# EAGLE design BIRDS_X_APRS_v1.4 (EAGLE 9.6.2)

## Sheet 1 of 3: MULTI-SPEC CAMERA MISSION
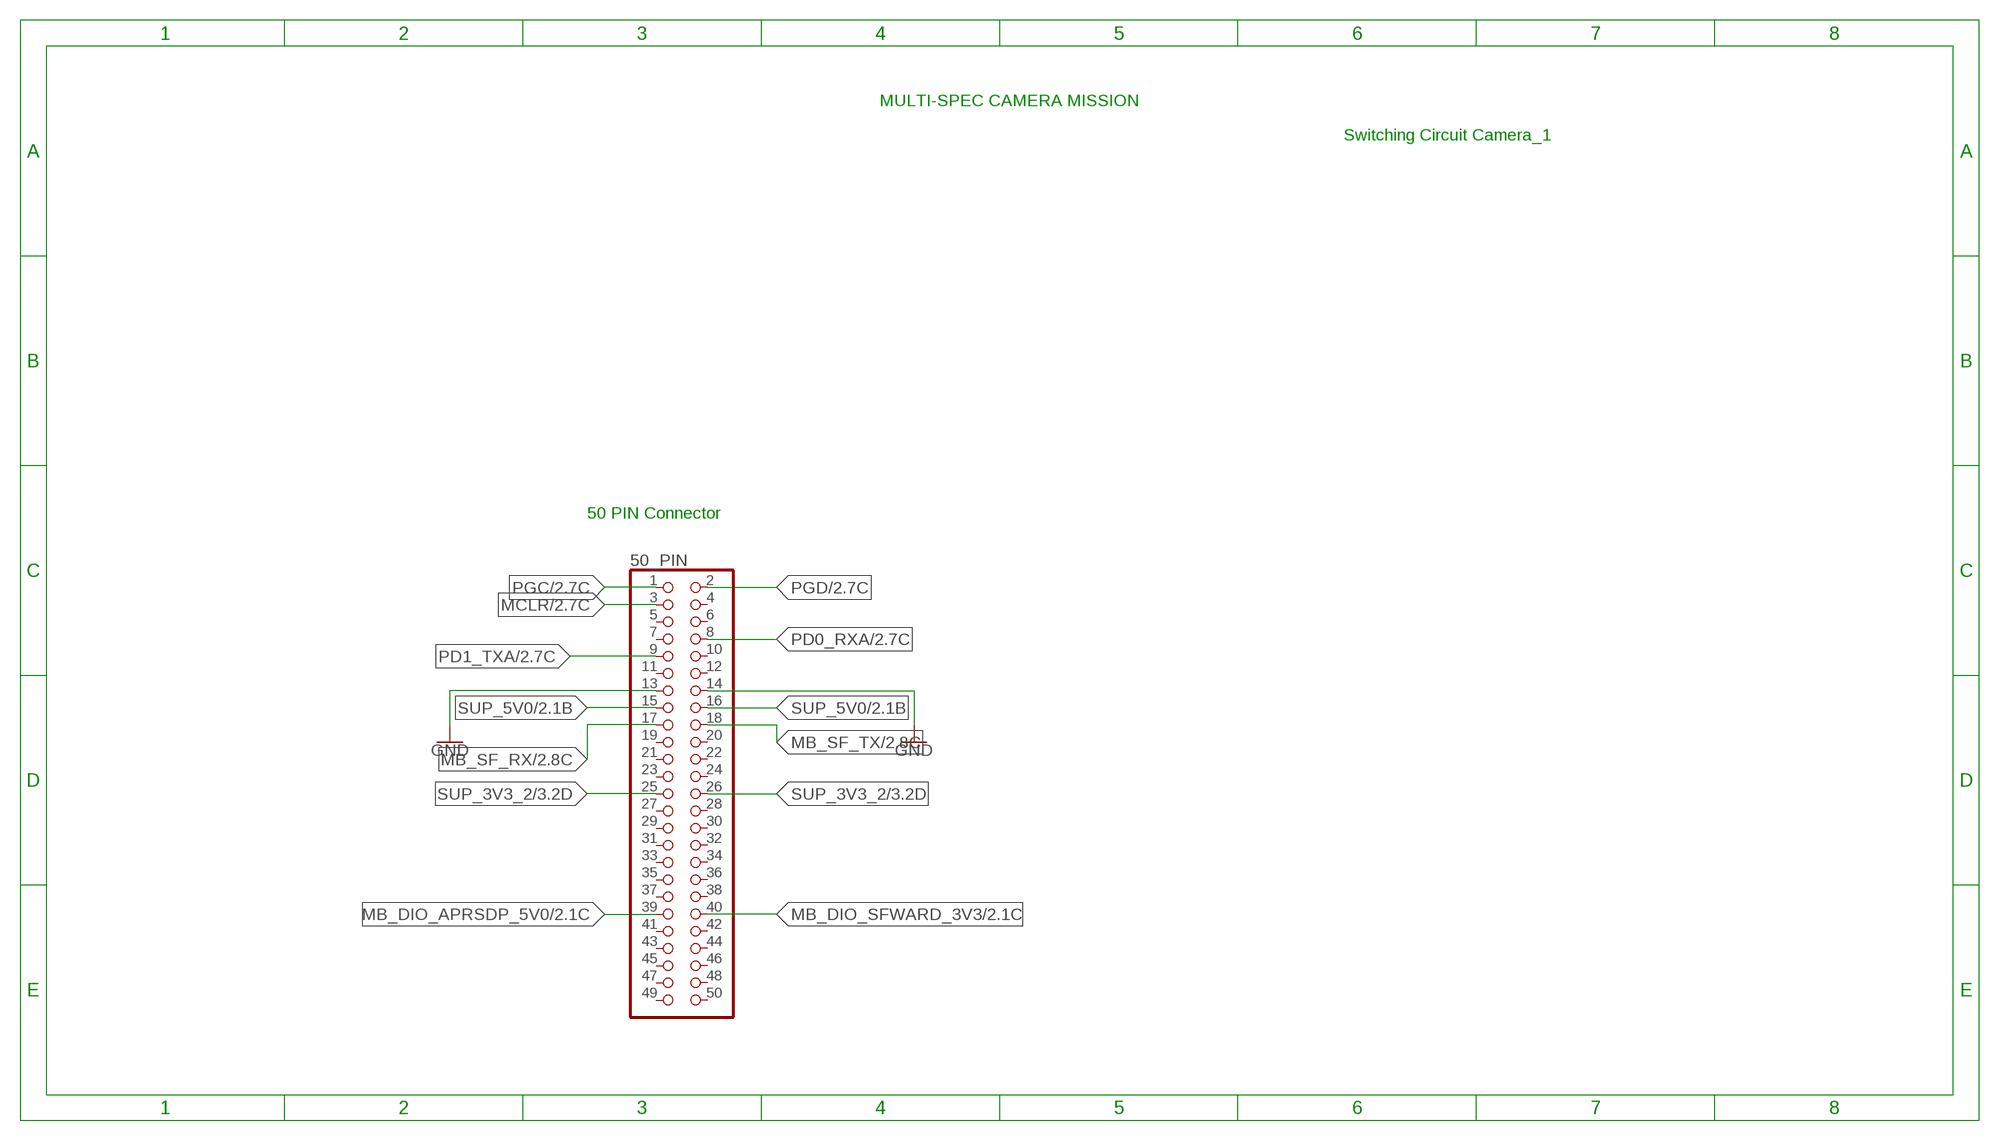
[diagram p0: schematic, sheet 1]

### Parts
50_PIN  PINHD-2X25_2.00  [2X25M]

### Nets
GND: 50_PIN.13 50_PIN.14 ; also sheet 2,3
MB_DIO_APRSDP_5V0: 50_PIN.39 ; also sheet 2
MB_DIO_SFWARD_3V3: 50_PIN.40 ; also sheet 2,3
MB_SF_RX/2.8C: 50_PIN.17
MB_SF_TX/2.8C: 50_PIN.18
MCLR: 50_PIN.3 ; also sheet 2,3
PD0_RXA: 50_PIN.8 ; also sheet 2
PD1_TXA: 50_PIN.9 ; also sheet 2
PGC: 50_PIN.1 ; also sheet 2,3
PGD: 50_PIN.2 ; also sheet 2,3
SUP_3V3_2: 50_PIN.25 50_PIN.26 ; also sheet 3
SUP_5V0: 50_PIN.15 50_PIN.16 ; also sheet 2
Unconnected: 50_PIN.4 50_PIN.5 50_PIN.6 50_PIN.7 50_PIN.10 50_PIN.11 50_PIN.12 50_PIN.19 50_PIN.20 50_PIN.21 50_PIN.22 50_PIN.23 50_PIN.24 50_PIN.27 50_PIN.28 50_PIN.29 50_PIN.30 50_PIN.31 50_PIN.32 50_PIN.33 50_PIN.34 50_PIN.35 50_PIN.36 50_PIN.37 50_PIN.38 50_PIN.41 50_PIN.42 50_PIN.43 50_PIN.44 50_PIN.45 50_PIN.46 50_PIN.47 50_PIN.48 50_PIN.49 50_PIN.50

### Notes on the sheet
- MULTI-SPEC CAMERA MISSION
- Switching Circuit Camera_1
- 50 PIN Connector

## Sheet 2 of 3: APRS/DP MISSION
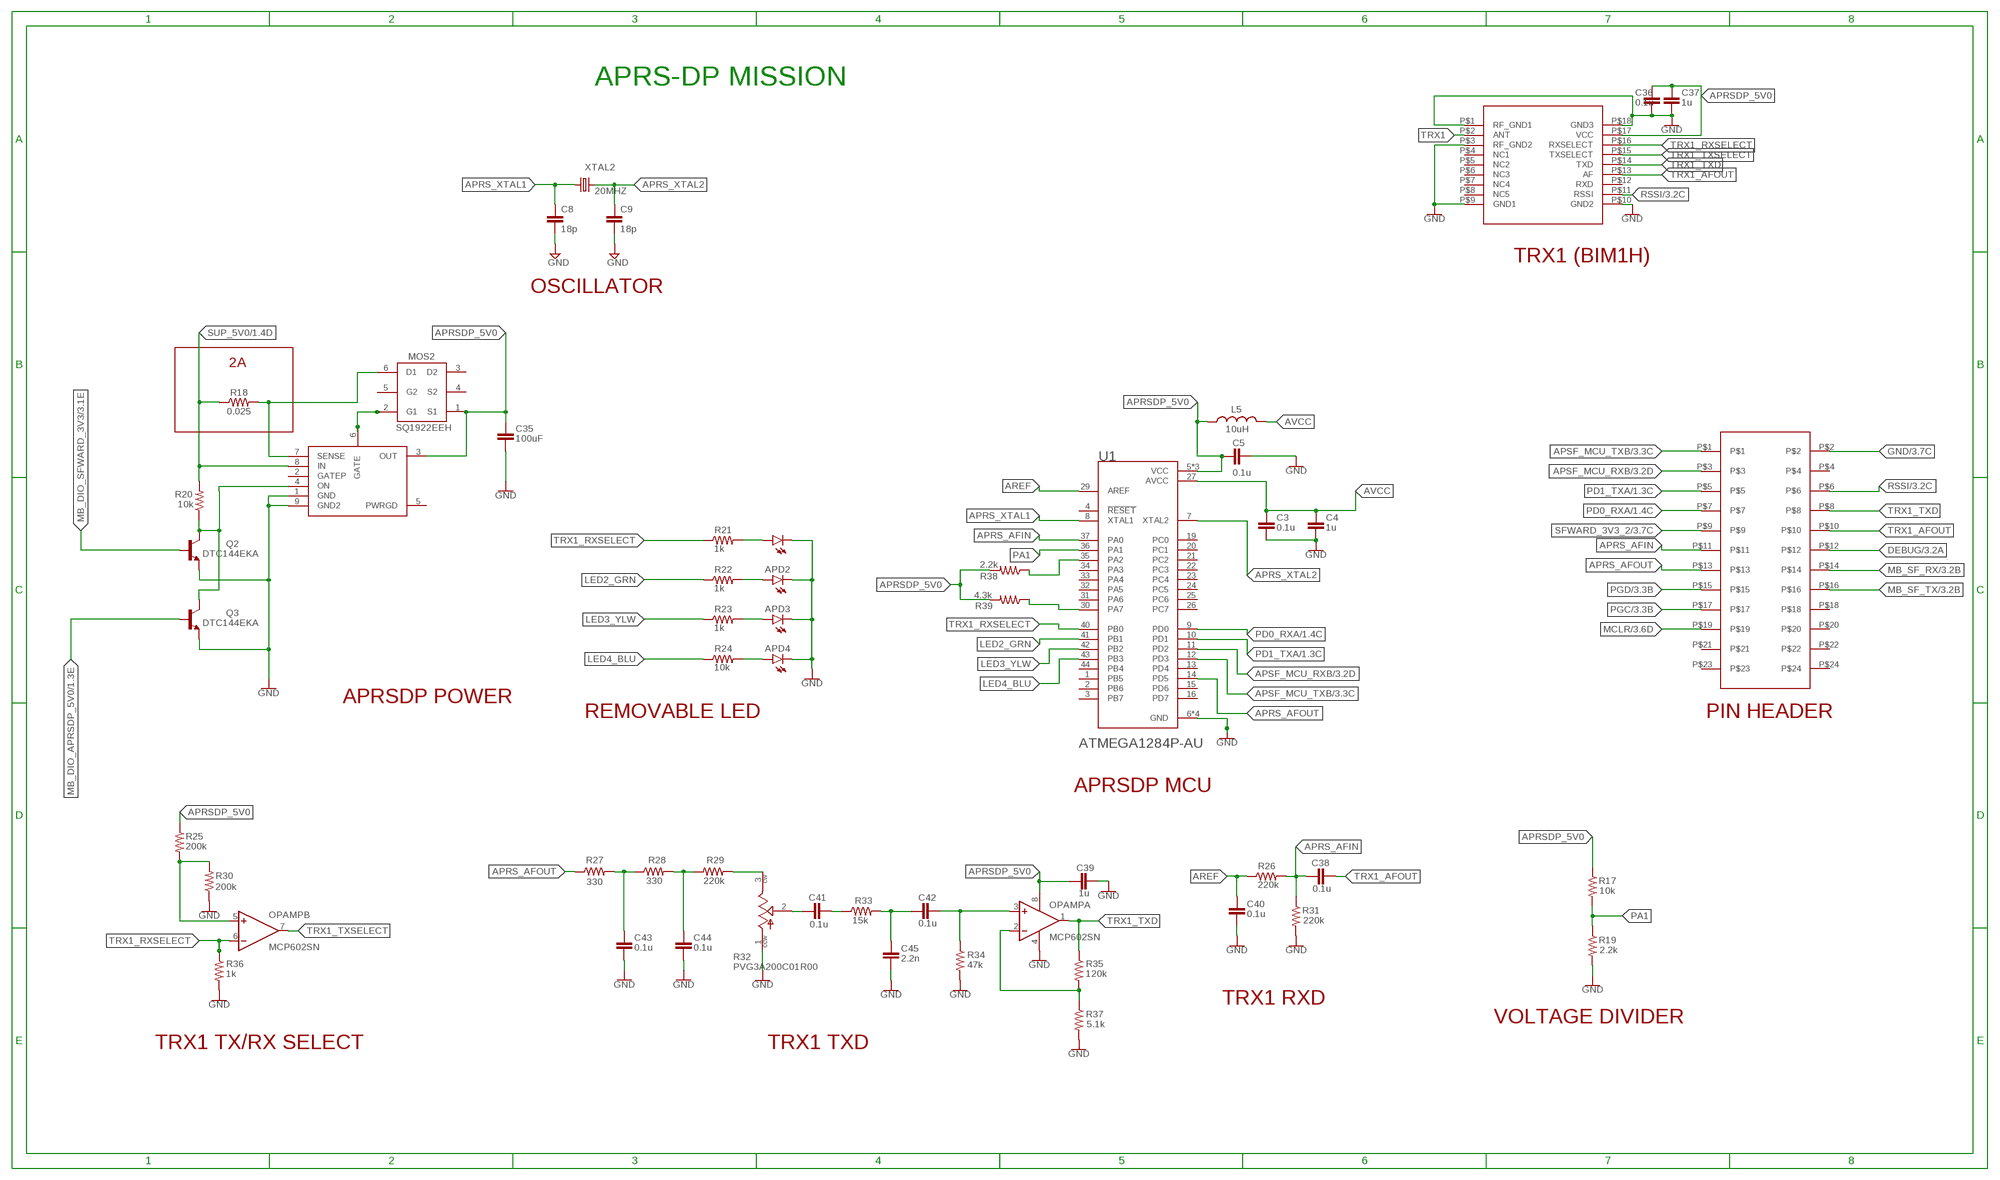
[diagram p1: schematic, sheet 2]

### Parts
APD1  LEDSML0603  [SML0603]
APD2  LEDSML0603  [SML0603]
APD3  LEDSML0603  [SML0603]
APD4  LEDSML0603  [SML0603]
C3  0.1u  CC0603  [C0603]
C4  1u  CC0603  [C0603]
C5  0.1u  CC0603  [C0603]
C8  18p  C  [C0805]
C9  18p  C  [C0805]
C35  100uF  C0805(2012)  [C0805]
C36  0.1u  CC0603  [C0603]
C37  1u  CC0603  [C0603]
C38  0.1u  CC0603  [C0603]
C39  1u  CC0603  [C0603]
C40  0.1u  CC0603  [C0603]
C41  0.1u  CC0603  [C0603]
C42  0.1u  CC0603  [C0603]
C43  0.1u  CC0603  [C0603]
C44  0.1u  CC0603  [C0603]
C45  2.2n  CC0603  [C0603]
JP1  RAB_ACCESS  [RAB_ACCESS]
L5  10uH  L-USL2012C  [L2012C]
MOS2  SQ1922EEH  [SOT65P210X110-6N]
OPAMP  MCP602SN  [SO08]
Q2  DTC144EKA  [SOT346-R]
Q3  DTC144EKA  [SOT346-R]
R17  10k  R-US_R0603  [R0603]
R18  0.025  R-US_R0805  [R0805]
R19  2.2k  R-US_R0603  [R0603]
R20  10k  R-US_R0603  [R0603]
R21  1k  R-US_R0603  [R0603]
R22  1k  R-US_R0603  [R0603]
R23  1k  R-US_R0603  [R0603]
R24  10k  R-US_R0603  [R0603]
R25  200k  R-US_R0603  [R0603]
R26  220k  R-US_R0603  [R0603]
R27  330  R-US_R0603  [R0603]
R28  330  R-US_R0603  [R0603]
R29  220k  R-US_R0603  [R0603]
R30  200k  R-US_R0603  [R0603]
R31  220k  R-US_R0603  [R0603]
R32  PVG3A200C01R00  [TRIM_PVG3A200C01R00]
R33  15k  R-US_R0603  [R0603]
R34  47k  R-US_R0603  [R0603]
R35  120k  R-US_R0603  [R0603]
R36  1k  R-US_R0603  [R0603]
R37  5.1k  R-US_R0603  [R0603]
R38  2.2k  R-US_R0603  [R0603]
R39  4.3k  R-US_R0603  [R0603]
TRX1  BIM1H  [BIM1H]
U1  ATMEGA1284P-AU  [QFP80P1200X1200X120-44N]
U$1  BIRDS5_LTC4361  [BIRDS5_LTC4361]
XTAL2  20MHZ  CRYSTALSM49  [SM49]

### Nets
APRS_AFIN: C38.1 JP1.P$11 R26.2 R31.1 U1.37(PA0)
APRS_AFOUT: JP1.P$13 R27.1 U1.14(PD5)
APRS_XTAL1: C8.1 U1.8(XTAL1) XTAL2.1
APRS_XTAL2: C9.1 U1.7(XTAL2) XTAL2.2
APRSDP_5V0: C5.2 C35.1 C36.1 C37.1 C39.1 L5.1 MOS2.1(S1) OPAMP.8(P:V+) R17.1 R25.1 R38.2 R39.2 TRX1.P$17(VCC) U1.5(VCC) U1.17(VCC) U1.38(VCC) U$1.3(OUT)
APSF_MCU_RXB: JP1.P$3 ; also sheet 3
APSF_MCU_RXB/3.2D: U1.11(PD2)
APSF_MCU_TXB: JP1.P$1 ; also sheet 3
APSF_MCU_TXB/3.3C: U1.12(PD3)
AREF: C40.1 R26.1 U1.29(AREF)
AVCC: C3.1 C4.1 L5.2 U1.27(AVCC)
DEBUG: JP1.P$12 ; also sheet 3
GATE4: MOS2.2(G1) U$1.6(GATE)
GND: APD1.C APD2.C APD3.C APD4.C C3.2 C4.2 C5.1 C8.2 C9.2 C35.2 C36.2 C37.2 C39.2 C40.2 C43.2 C44.2 C45.2 JP1.P$2 OPAMP.4(P:V-) Q2.1(E) Q3.1(E) R19.2 R30.1 R31.2 R32.1(CCW) R34.2 R36.2 R37.2 TRX1.P$1(RF_GND1) TRX1.P$3(RF_GND2) TRX1.P$9(GND1) TRX1.P$10(GND2) TRX1.P$18(GND3) U1.6(GND) U1.18(GND) U1.28(GND) U1.39(GND) U$1.1(GND) U$1.9(GND2) ; also sheet 1,3
LED2_GRN: R22.1 U1.41(PB1)
LED3_YLW: R23.1 U1.42(PB2)
LED4_BLU: R24.1 U1.43(PB3)
MB_DIO_APRSDP_5V0: Q3.2(B) ; also sheet 1
MB_DIO_SFWARD_3V3: Q2.2(B) ; also sheet 1,3
MB_SF_RX: JP1.P$14 ; also sheet 3
MB_SF_TX: JP1.P$16 ; also sheet 3
MCLR: JP1.P$19 ; also sheet 1,3
N$1: R38.1 U1.35(PA2)
N$3: R39.1 U1.30(PA7)
N$10: R29.2 R32.3(CW)
N$12: APD1.A R21.2
N$13: APD2.A R22.2
N$14: APD3.A R23.2
N$15: APD4.A R24.2
N$16: C43.1 R27.2 R28.1
N$17: C44.1 R28.2 R29.1
N$18: C42.1 C45.1 R33.2
N$19: C41.2 R33.1
N$20: OPAMP.2(A:-IN) R35.2 R37.1
N$21: OPAMP.5(B:+IN) R25.2 R30.2
N$22: C41.1 R32.2(WIPER)
ON4: Q2.3(C) Q3.3(C) R20.1 U$1.4(ON)
OPAMP_A+: C42.2 OPAMP.3(A:+IN) R34.1
PA1: R17.2 R19.1 U1.36(PA1)
PD0_RXA: JP1.P$7 ; also sheet 1
PD0_RXA/1.4C: U1.9(PD0)
PD1_TXA: JP1.P$5 ; also sheet 1
PD1_TXA/1.3C: U1.10(PD1)
PGC: JP1.P$17 ; also sheet 1,3
PGD: JP1.P$15 ; also sheet 1,3
RSSI: JP1.P$6 TRX1.P$11(RSSI) ; also sheet 3
SENSE4: MOS2.6(D1) R18.2 U$1.7(SENSE)
SFWARD_3V3_2: JP1.P$9 ; also sheet 3
SUP_5V0: R18.1 R20.2 U$1.8(IN) ; also sheet 1
TRX1: TRX1.P$2(ANT) ; also sheet 3
TRX1_AFOUT: C38.2 JP1.P$10 TRX1.P$13(AF)
TRX1_RXSELECT: OPAMP.6(B:-IN) R21.1 R36.1 TRX1.P$16(RXSELECT) U1.40(PB0)
TRX1_TXD: JP1.P$8 OPAMP.1(A:OUT) R35.1 TRX1.P$14(TXD)
TRX1_TXSELECT: OPAMP.7(B:OUT) TRX1.P$15(TXSELECT)
Unconnected: JP1.P$4 JP1.P$18 JP1.P$20 JP1.P$21 JP1.P$22 JP1.P$23 JP1.P$24 MOS2.3(D2) MOS2.4(S2) MOS2.5(G2) TRX1.P$4(NC1) TRX1.P$5(NC2) TRX1.P$6(NC3) TRX1.P$7(NC4) TRX1.P$8(NC5) TRX1.P$12(RXD) U1.1(PB5) U1.2(PB6) U1.3(PB7) U1.4(!RESET) U1.13(PD4) U1.15(PD6) U1.16(PD7) U1.19(PC0) U1.20(PC1) U1.21(PC2) U1.22(PC3) U1.23(PC4) U1.24(PC5) U1.25(PC6) U1.26(PC7) U1.31(PA6) U1.32(PA5) U1.33(PA4) U1.34(PA3) U1.44(PB4) U$1.2(GATEP) U$1.5(PWRGD)

### Notes on the sheet
- APRS-DP MISSION
- TRX1 (BIM1H)
- OSCILLATOR
- 2A
- APRSDP POWER
- REMOVABLE LED | PIN HEADER
- APRSDP MCU
- TRX1 RXD
- VOLTAGE DIVIDER
- TRX1 TX/RX SELECT | TRX1 TXD

## Sheet 3 of 3: SF-WARD MISSION
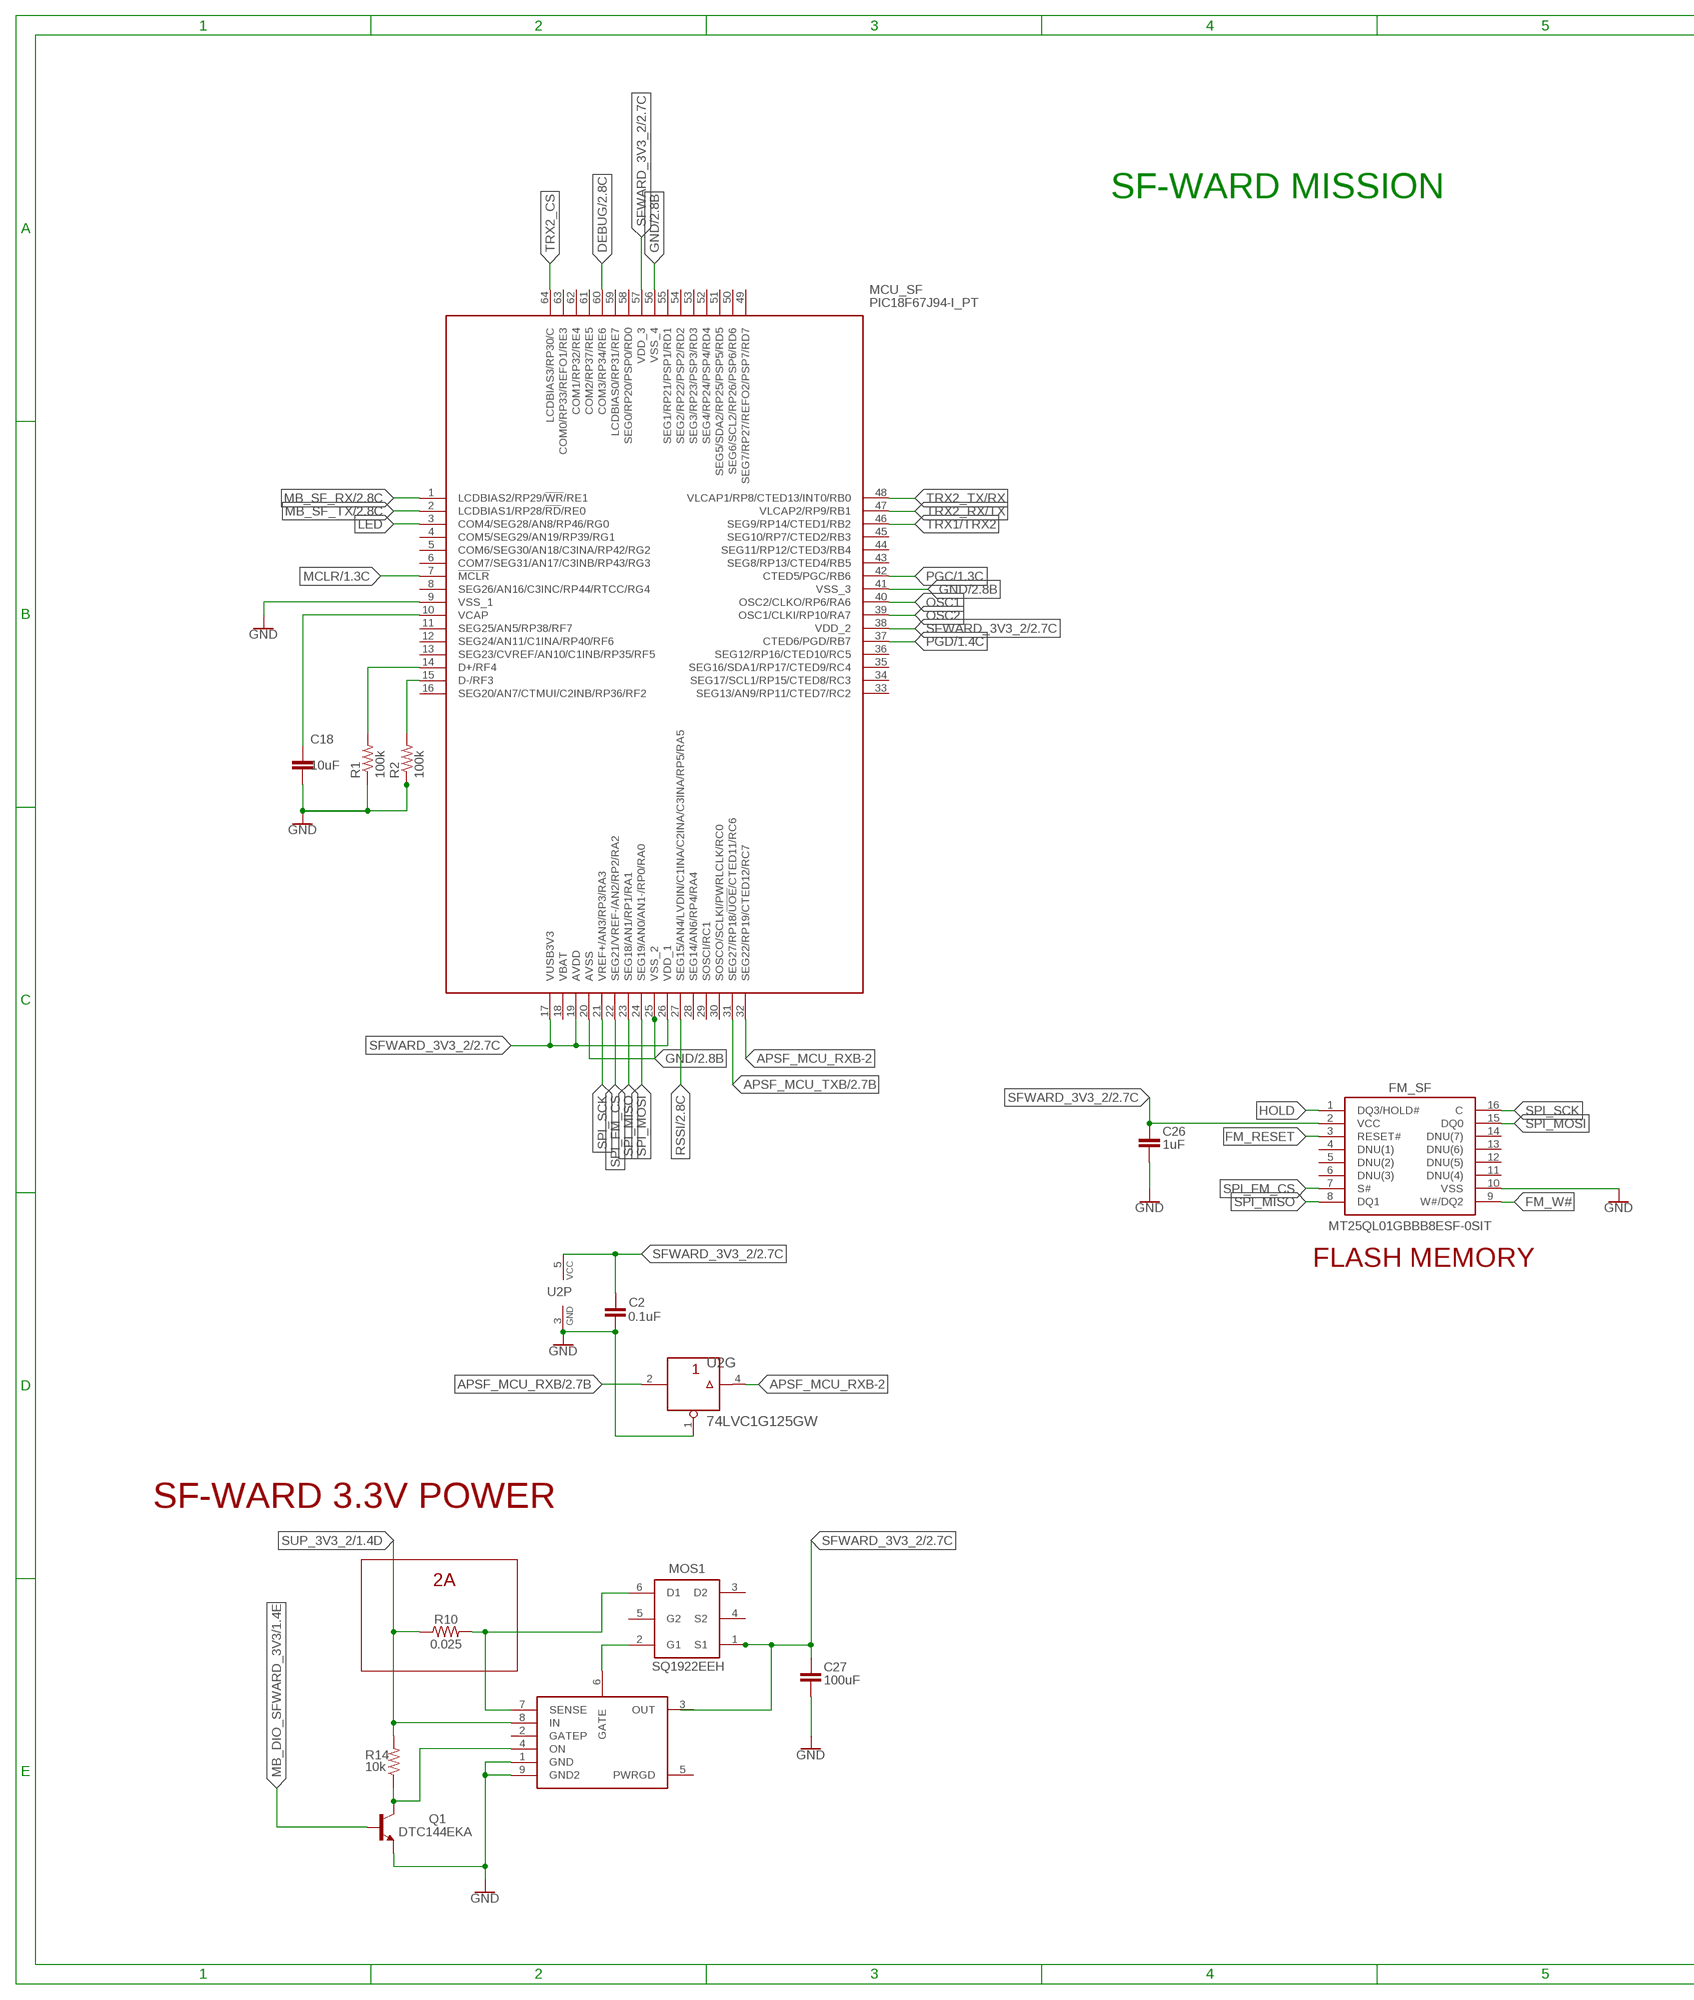
[diagram p2: schematic, sheet 3, part 1 of 2]
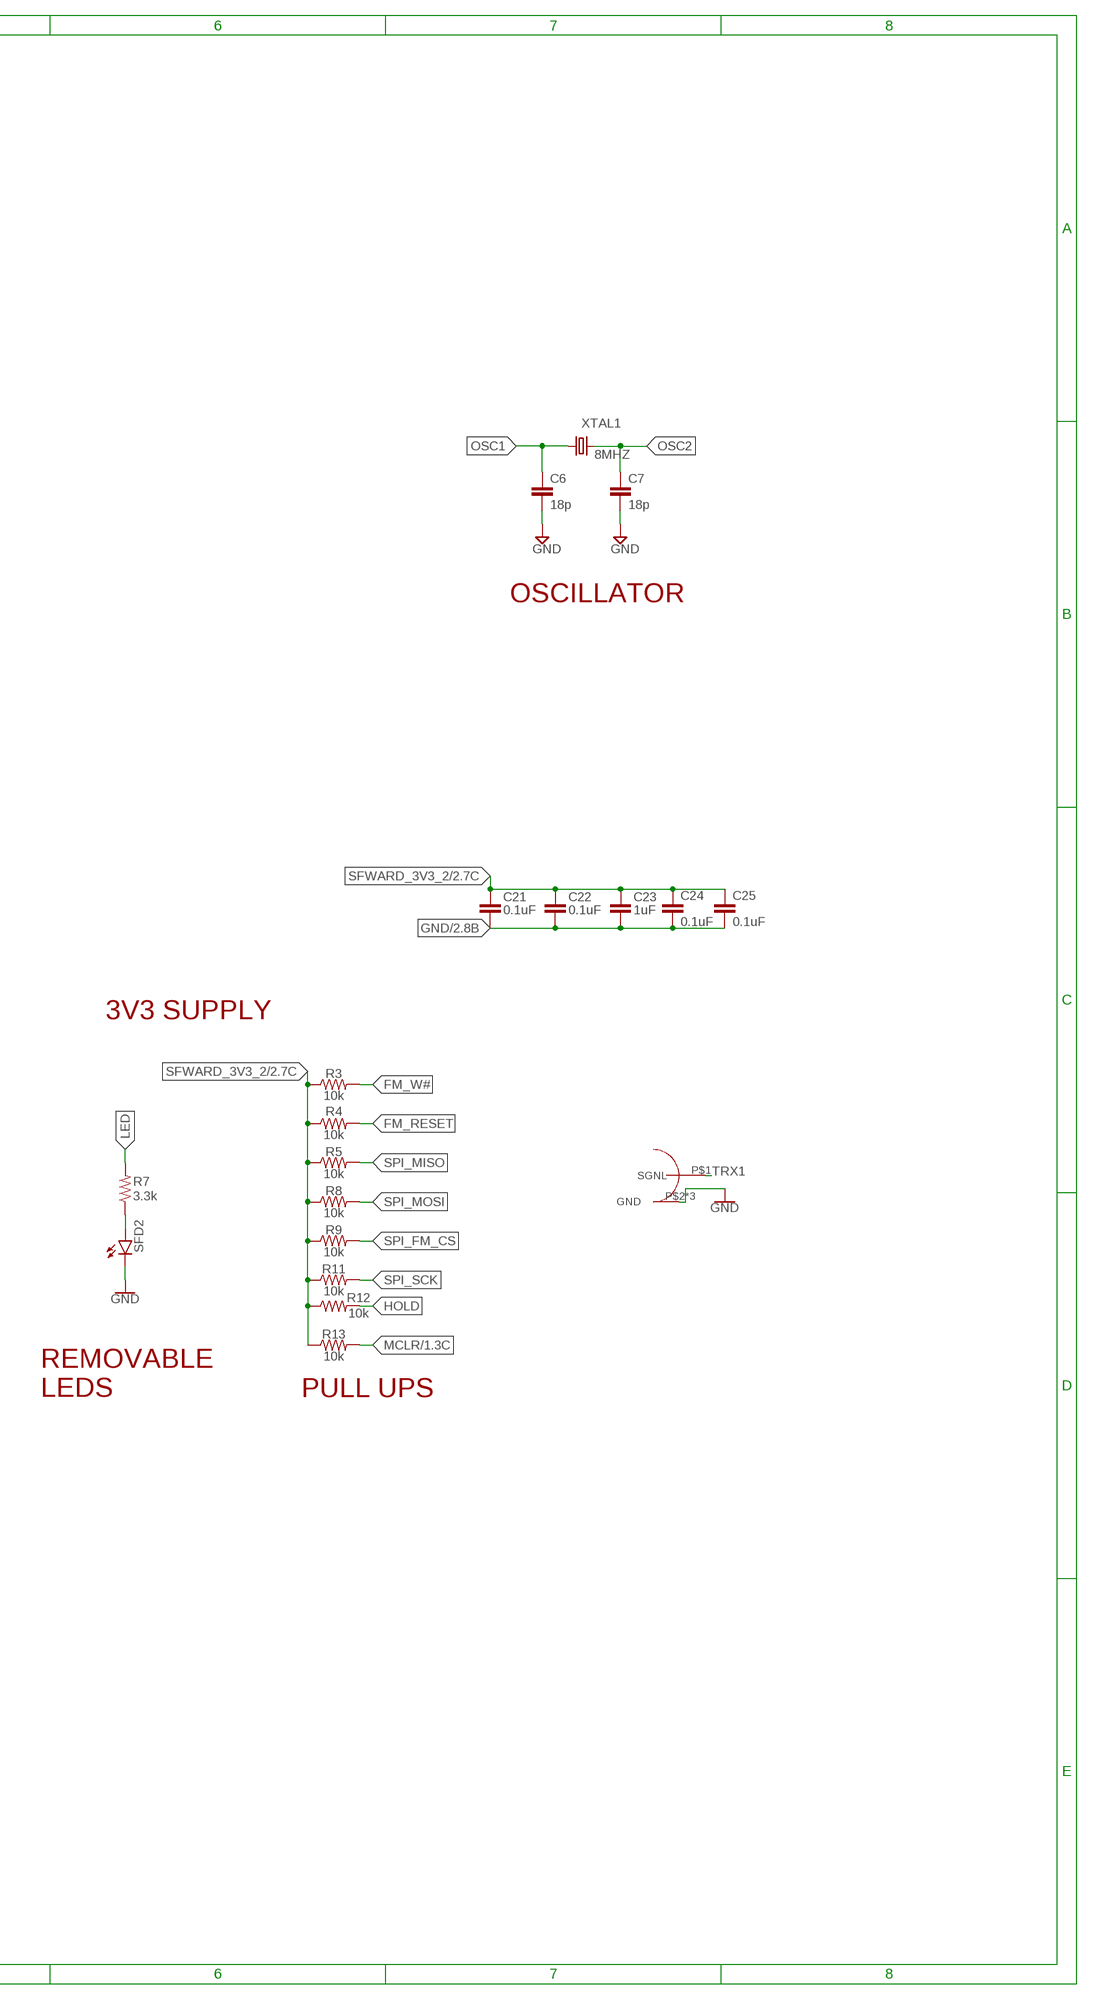
[diagram p3: schematic, sheet 3, part 2 of 2]

### Parts
C2  0.1uF  CC0603  [C0603]
C6  18p  C  [C0805]
C7  18p  C  [C0805]
C18  10uF  C-EUC0603  [C0603]
C21  0.1uF  C-EUC0603  [C0603]
C22  0.1uF  C-EUC0603  [C0603]
C23  1uF  C-EUC0603  [C0603]
C24  0.1uF  C-EUC0603  [C0603]
C25  0.1uF  C-EUC0603  [C0603]
C26  1uF  C-EUC0603  [C0603]
C27  100uF  C0805(2012)  [C0805]
FM_SF  MT25QL01GBBB8ESF-0SIT  [SOIC127P1032X265-16N]
MCU_SF  PIC18F67J94-I_PT  [QFP50P1200X1200X120-64N]
MMCX_908_222101T  MMCX_908_222101T  [MMCX_908_222101T]
MOS1  SQ1922EEH  [SOT65P210X110-6N]
Q1  DTC144EKA  [SOT346-R]
R1  100k  R-US_R0603  [R0603]
R2  100k  R-US_R0603  [R0603]
R3  10k  R-US_R0603  [R0603]
R4  10k  R-US_R0603  [R0603]
R5  10k  R-US_R0603  [R0603]
R7  3.3k  R-US_R0603  [R0603]
R8  10k  R-US_R0603  [R0603]
R9  10k  R-US_R0603  [R0603]
R10  0.025  R0805(2012)  [R0805]
R11  10k  R-US_R0603  [R0603]
R12  10k  R-US_R0603  [R0603]
R13  10k  R-US_R0603  [R0603]
R14  10k  R-US_R0603  [R0603]
SFD2  LEDCHIPLED_0603  [CHIPLED_0603]
U2  74LVC1G125GW  [SOT353-1]
U$3  BIRDS5_LTC4361  [BIRDS5_LTC4361]
XTAL1  8MHZ  CRYSTALSM49  [SM49]

### Nets
APSF_MCU_RXB: U2.2(G:A) ; also sheet 2
APSF_MCU_RXB-2: MCU_SF.32(SEG22/RP19/CTED12/RC7) U2.4(G:Y)
APSF_MCU_TXB: MCU_SF.31(SEG27/RP18/!UOE!/CTED11/RC6) ; also sheet 2
DEBUG: MCU_SF.60(COM3/RP34/RE6) ; also sheet 2
FM_RESET: FM_SF.3(RESET#) R4.2
FM_W#: FM_SF.9(W#/DQ2) R3.2
GATE3: MOS1.2(G1) U$3.6(GATE)
GND: C2.1 C6.2 C7.2 C18.2 C21.2 C22.2 C23.2 C24.2 C25.2 C26.2 C27.2 FM_SF.10(VSS) MCU_SF.9(VSS_1) MCU_SF.20(AVSS) MCU_SF.25(VSS_2) MCU_SF.41(VSS_3) MCU_SF.56(VSS_4) MMCX_908_222101T.P$2(GND) MMCX_908_222101T.P$3(GND) MMCX_908_222101T.P$4(GND) Q1.1(E) R1.1 R2.1 SFD2.C U2.1(G:OEN) U2.3(P:GND) U$3.1(GND) U$3.9(GND2) ; also sheet 1,2
HOLD: FM_SF.1(DQ3/HOLD#) R12.2
LED: MCU_SF.3(COM4/SEG28/AN8/RP46/RG0) R7.2
MB_DIO_SFWARD_3V3: Q1.2(B) ; also sheet 1,2
MB_SF_RX: MCU_SF.1(LCDBIAS2/RP29/!WR!/RE1) ; also sheet 2
MB_SF_TX: MCU_SF.2(LCDBIAS1/RP28/!RD!/RE0) ; also sheet 2
MCLR: MCU_SF.7(!MCLR) R13.2 ; also sheet 1,2
N$2: C18.1 MCU_SF.10(VCAP)
N$7: MCU_SF.14(D+/RF4) R1.2
N$8: MCU_SF.15(D-/RF3) R2.2
N$11: R7.1 SFD2.A
ON3: Q1.3(C) R14.1 U$3.4(ON)
OSC1: C6.1 MCU_SF.40(OSC2/CLKO/RP6/RA6) XTAL1.1
OSC2: C7.1 MCU_SF.39(OSC1/CLKI/RP10/RA7) XTAL1.2
PGC: MCU_SF.42(CTED5/PGC/RB6) ; also sheet 1,2
PGD: MCU_SF.37(CTED6/PGD/RB7) ; also sheet 1,2
RSSI: MCU_SF.27(SEG15/AN4/LVDIN/C1INA/C2INA/C3INA/RP5/RA5) ; also sheet 2
SENSE3: MOS1.6(D1) R10.2 U$3.7(SENSE)
SFWARD_3V3_2: C2.2 C21.1 C22.1 C23.1 C24.1 C25.1 C26.1 C27.1 FM_SF.2(VCC) MCU_SF.17(VUSB3V3) MCU_SF.19(AVDD) MCU_SF.26(VDD_1) MCU_SF.38(VDD_2) MCU_SF.57(VDD_3) MOS1.1(S1) R3.1 R4.1 R5.1 R8.1 R9.1 R11.1 R12.1 R13.1 U2.5(P:VCC) U$3.3(OUT) ; also sheet 2
SPI_FM_CS: FM_SF.7(S#) MCU_SF.22(SEG21/VREF-/AN2/RP2/RA2) R9.2
SPI_MISO: FM_SF.8(DQ1) MCU_SF.23(SEG18/AN1/RP1/RA1) R5.2
SPI_MOSI: FM_SF.15(DQ0) MCU_SF.24(SEG19/AN0/AN1-/RP0/RA0) R8.2
SPI_SCK: FM_SF.16(C) MCU_SF.21(VREF+/AN3/RP3/RA3) R11.2
SUP_3V3_2: R10.1 R14.2 U$3.8(IN) ; also sheet 1
TRX1: MMCX_908_222101T.P$1(SGNL) ; also sheet 2
TRX1/TRX2: MCU_SF.46(SEG9/RP14/CTED1/RB2)
TRX2_CS: MCU_SF.64(LCDBIAS3/RP30/C)
TRX2_RX/TX: MCU_SF.47(VLCAP2/RP9/RB1)
TRX2_TX/RX: MCU_SF.48(VLCAP1/RP8/CTED13/INT0/RB0)
Unconnected: FM_SF.4(DNU(1)) FM_SF.5(DNU(2)) FM_SF.6(DNU(3)) FM_SF.11(DNU(4)) FM_SF.12(DNU(5)) FM_SF.13(DNU(6)) FM_SF.14(DNU(7)) MCU_SF.4(COM5/SEG29/AN19/RP39/RG1) MCU_SF.5(COM6/SEG30/AN18/C3INA/RP42/RG2) MCU_SF.6(COM7/SEG31/AN17/C3INB/RP43/RG3) MCU_SF.8(SEG26/AN16/C3INC/RP44/RTCC/RG4) MCU_SF.11(SEG25/AN5/RP38/RF7) MCU_SF.12(SEG24/AN11/C1INA/RP40/RF6) MCU_SF.13(SEG23/CVREF/AN10/C1INB/RP35/RF5) MCU_SF.16(SEG20/AN7/CTMUI/C2INB/RP36/RF2) MCU_SF.18(VBAT) MCU_SF.28(SEG14/AN6/RP4/RA4) MCU_SF.29(SOSCI/RC1) MCU_SF.30(SOSCO/SCLKI/PWRLCLK/RC0) MCU_SF.33(SEG13/AN9/RP11/CTED7/RC2) MCU_SF.34(SEG17/SCL1/RP15/CTED8/RC3) MCU_SF.35(SEG16/SDA1/RP17/CTED9/RC4) MCU_SF.36(SEG12/RP16/CTED10/RC5) MCU_SF.43(SEG8/RP13/CTED4/RB5) MCU_SF.44(SEG11/RP12/CTED3/RB4) MCU_SF.45(SEG10/RP7/CTED2/RB3) MCU_SF.49(SEG7/RP27/REFO2/PSP7/RD7) MCU_SF.50(SEG6/SCL2/RP26/PSP6/RD6) MCU_SF.51(SEG5/SDA2/RP25/PSP5/RD5) MCU_SF.52(SEG4/RP24/PSP4/RD4) MCU_SF.53(SEG3/RP23/PSP3/RD3) MCU_SF.54(SEG2/RP22/PSP2/RD2) MCU_SF.55(SEG1/RP21/PSP1/RD1) MCU_SF.58(SEG0/RP20/PSP0/RD0) MCU_SF.59(LCDBIAS0/RP31/RE7) MCU_SF.61(COM2/RP37/RE5) MCU_SF.62(COM1/RP32/RE4) MCU_SF.63(COM0/RP33/REFO1/RE3) MOS1.3(D2) MOS1.4(S2) MOS1.5(G2) U$3.2(GATEP) U$3.5(PWRGD)

### Notes on the sheet
- SF-WARD MISSION
- OSCILLATOR
- 3V3 SUPPLY
- FLASH MEMORY
- REMOVABLE
  LEDS
- PULL UPS
- SF-WARD 3.3V POWER
- 2A

## Library data of the parts
50_PIN = pinhead-1:PINHD-2X25: PIN HEADER
APD1-APD4 SFD2 = led:LED: LED OSRAM: - CHIPLED LG R971, LG N971, LY N971, LG Q971, LY Q971, LO R971, LY R971 LH N974, LH R974 LS Q976, LO Q976, LY Q976 LO Q996 - Hyper CHIPLED LW Q18S LB Q993, LB Q99A, LB R99A - SideLED LS A670, LO A670, LY A670, LG A670, LP A670 LB A673, LV A673, LT A673, LW A673 LH A674 LY A675 LS A676, LA A676, LO A676, LY A676, LW A676 LS A679, LY A679, LG A679 - Hyper Micro SIDELED® LS Y876, LA Y876, LO Y876, LY Y876 LT Y87S - SmartLED LW L88C, LW L88S LB L89C, LB L89S, LG L890 LS L89K, LO L89K, LY L89K LS L896, LA L896, LO L896, LY L896 - TOPLED LS T670, LO T670, LY T670, LG T670, LP T670 LSG T670, LSP T670, LSY T670, LOP T670, LYG T670 LG T671, LOG T671, LSG T671 LB T673, LV T673, LT T673, LW T673 LH T674 LS T676, LA T676, LO T676, LY T676, LB T676, LH T676, LSB T676, LW T676 LB T67C, LV T67C, LT T67C, LS T67K, LO T67K, LY T67K, LW E67C LS E67B, LA E67B, LO E67B, LY E67B, LB E67C, LV E67C, LT E67C LW T67C LS T679, LY T679, LG T679 LS T770, LO T770, LY T770, LG T770, LP T770 LB T773, LV T773, LT T773, LW T773 LH T774 LS E675, LA E675, LY E675, LS T675 LS T776, LA T776, LO T776, LY T776, LB T776 LHGB T686 LT T68C, LB T68C - Hyper Mini TOPLED® LB M676 - Mini TOPLED Santana® LG M470 LS M47K, LO M47K, LY M47K Source: http://www.osram.convergy.de LUXEON: - LUMILED® LXK2-PW12-R00, LXK2-PW12-S00, LXK2-PW14-U00, LXK2-PW14-V00 LXK2-PM12-R00, LXK2-PM12-S00, LXK2-PM14-U00 LXK2-PE12-Q00, LXK2-PE12-R00, LXK2-PE12-S00, LXK2-PE14-T00, LXK2-PE14-U00 LXK2-PB12-K00, LXK2-PB12-L00, LXK2-PB12-M00, LXK2-PB14-N00, LXK2-PB14-P00, LXK2-PB14-Q00 LXK2-PR12-L00, LXK2-PR12-M00, LXK2-PR14-Q00, LXK2-PR14-R00 LXK2-PD12-Q00, LXK2-PD12-R00, LXK2-PD12-S00 LXK2-PH12-R00, LXK2-PH12-S00 LXK2-PL12-P00, LXK2-PL12-Q00, LXK2-PL12-R00 Source: www.luxeon.com KINGBRIGHT: KA-3528ASYC Source: www.kingbright.com
C2-C9 C36-C45 = eagle-ltspice:C: CAPACITOR, European symbol; SPICEMODEL: NONE; SPICEPREFIX: C
C18 C21-C26 = rcl:C-EU: CAPACITOR, European symbol; SPICEPREFIX: C
C27 C35 = BIRDS3_CAM_MSN:C0805(2012)
FM_SF = BIRDS3_CAM_MSN:MT25QL01GBBB8ESF-0SIT: IC FLASH 1GBIT 108MHZ 16SOIC Source: Datasheet <https://www.micron.com/~/media/documents/products/data-sheet/nor-flash/serial-nor/mt25q/die-rev-b/mt25q_qlkt_l_01g_bbb_0.pdf>; DESCRIPTION: IC FLASH 1GBIT 108MHZ 16SOIC; HEIGHT: 2.65mm; MANUFACTURER_NAME: Micron; MANUFACTURER_PART_NUMBER: MT25QL01GBBB8ESF-0SIT; SUPPLIER_NAME: RS
JP1 = BIRDS_4_general_components_library:RAB_ACCESS
L5 = rcl:L-US: INDUCTOR, American symbol; SPICEPREFIX: L
MCU_SF = PIC18F67J94-I_PT:PIC18F67J94-I_PT: MCU 8-Bit 128K Flash LCD USB XLP TQFP64 Microchip PIC18F67J94-I/PT, 8bit PIC Microcontroller, 64MHz, 128 kB Flash, 64-Pin TQFP Source: Datasheet <http://uk.rs-online.com/web/p/products/8233908>; ALLIED_NUMBER: 70470236; ALLIED_PRICE-STOCK: https://www.alliedelec.com/microchip-technology-inc-pic18f67j94-i-pt/70470236/; DESCRIPTION: MCU 8-Bit 128K Flash LCD USB XLP TQFP64 Microchip PIC18F67J94-I/PT, 8bit PIC Microcontroller, 64MHz, 128 kB Flash, 64-Pin TQFP; HEIGHT: 1.2mm; MANUFACTURER_NAME: Microchip; MANUFACTURER_PART_NUMBER: PIC18F67J94-I/PT; MOUSER_PART_NUMBER: 579-PIC18F67J94-I/PT; MOUSER_PRICE-STOCK: https://www.mouser.com/Search/Refine.aspx?Keyword=579-PIC18F67J94-I%2FPT; RS_PART_NUMBER: 1652172; RS_PRICE-STOCK: http://uk.rs-online.com/web/p/products/1652172
MMCX_908_222101T = BIRDS_4_general_components_library:MMCX_908_222101T
MOS1 MOS2 = BIRDS3_CAM_MSN:SQ1922EEH
OPAMP = linear:MCP602: Single Op Amp 2.7V to 6.0V Single Supply CMOS Source: http://ww1.microchip.com/downloads/en/DeviceDoc/21314g.pdf
Q1-Q3 = BIRDS3_CAM_MSN:DTC144EKA
R1-R5 R7-R9 R11-R14 R17-R31 R33-R39 = rcl:R-US_: RESISTOR, American symbol; SPICEPREFIX: R
R10 = BIRDS3_CAM_MSN:R0805(2012)
R32 = PVG3A200C01R00:PVG3A200C01R00: Res Cermet Trimmer 20 Ohm 20% 1/4W 1(Elec)/1(Mech)Turn 2.2mm (3.6 X 3.6 X 2mm) J-Hook SMD T/R; DESCRIPTION: Trimmer 20 Ohm 0.25w Smd; DIGI-KEY_PART_NUMBER: 490-2647-1-ND; DIGI-KEY_PURCHASE_URL: https://www.digikey.jp/product-detail/en/bourns-inc/PVG3A200C01R00/490-2647-1-ND/666223?utm_source=snapeda&utm_medium=aggregator&utm_campaign=symbol; MF: Bourns; MP: PVG3A200C01R00; PACKAGE: TO-221 Bourns
TRX1 = BIRDS_4_general_components_library:BIM1H
U1 = ATMEGA1284P-AU:ATMEGA1284P-AU: ATmega Series 20 MHz 128 KB Flash 16 KB SRAM 8-Bit Microcontroller - TQFP-44 Check availability <https://pricing.snapeda.com/parts/ATMEGA1284P-AU/Microchip/view-part?ref=eda>; AVAILABILITY: In Stock; DESCRIPTION: AVR AVR® ATmega Microcontroller IC 8-Bit 20MHz 128KB (64K x 16) FLASH 44-TQFP (10x10); MF: Microchip; MP: ATMEGA1284P-AU; PACKAGE: TQFP-44 Microchip; PRICE: None; PURCHASE-URL: https://pricing.snapeda.com/search/part/ATMEGA1284P-AU/?ref=eda
U2 = Buffers:74LVC1G125: Bus buffer/line driver; 3-state The 74LVC1G125 provides one non-inverting buffer/line driver with 3-state output. The 3-state output is controlled by the output enable input (OE). A HIGH-level at pin OE causes the output to assume a high-impedance OFF-state. The input can be driven from either 3.3 V or 5 V devices. This feature allows the use of this device in a mixed 3.3 V and 5 V environment. This device is fully specified for partial power-down applications using IOFF. The IOFF circuitry disables the output, preventing the damaging backflow current through the device when it is powered down. AAL Eindhoven MK
U$1 U$3 = BIRDS5_LTC4361:BIRDS5_LTC4361
XTAL1 XTAL2 = crystal:CRYSTAL: CRYSTAL; OC_FARNELL: unknown; OC_NEWARK: unknown

## Board
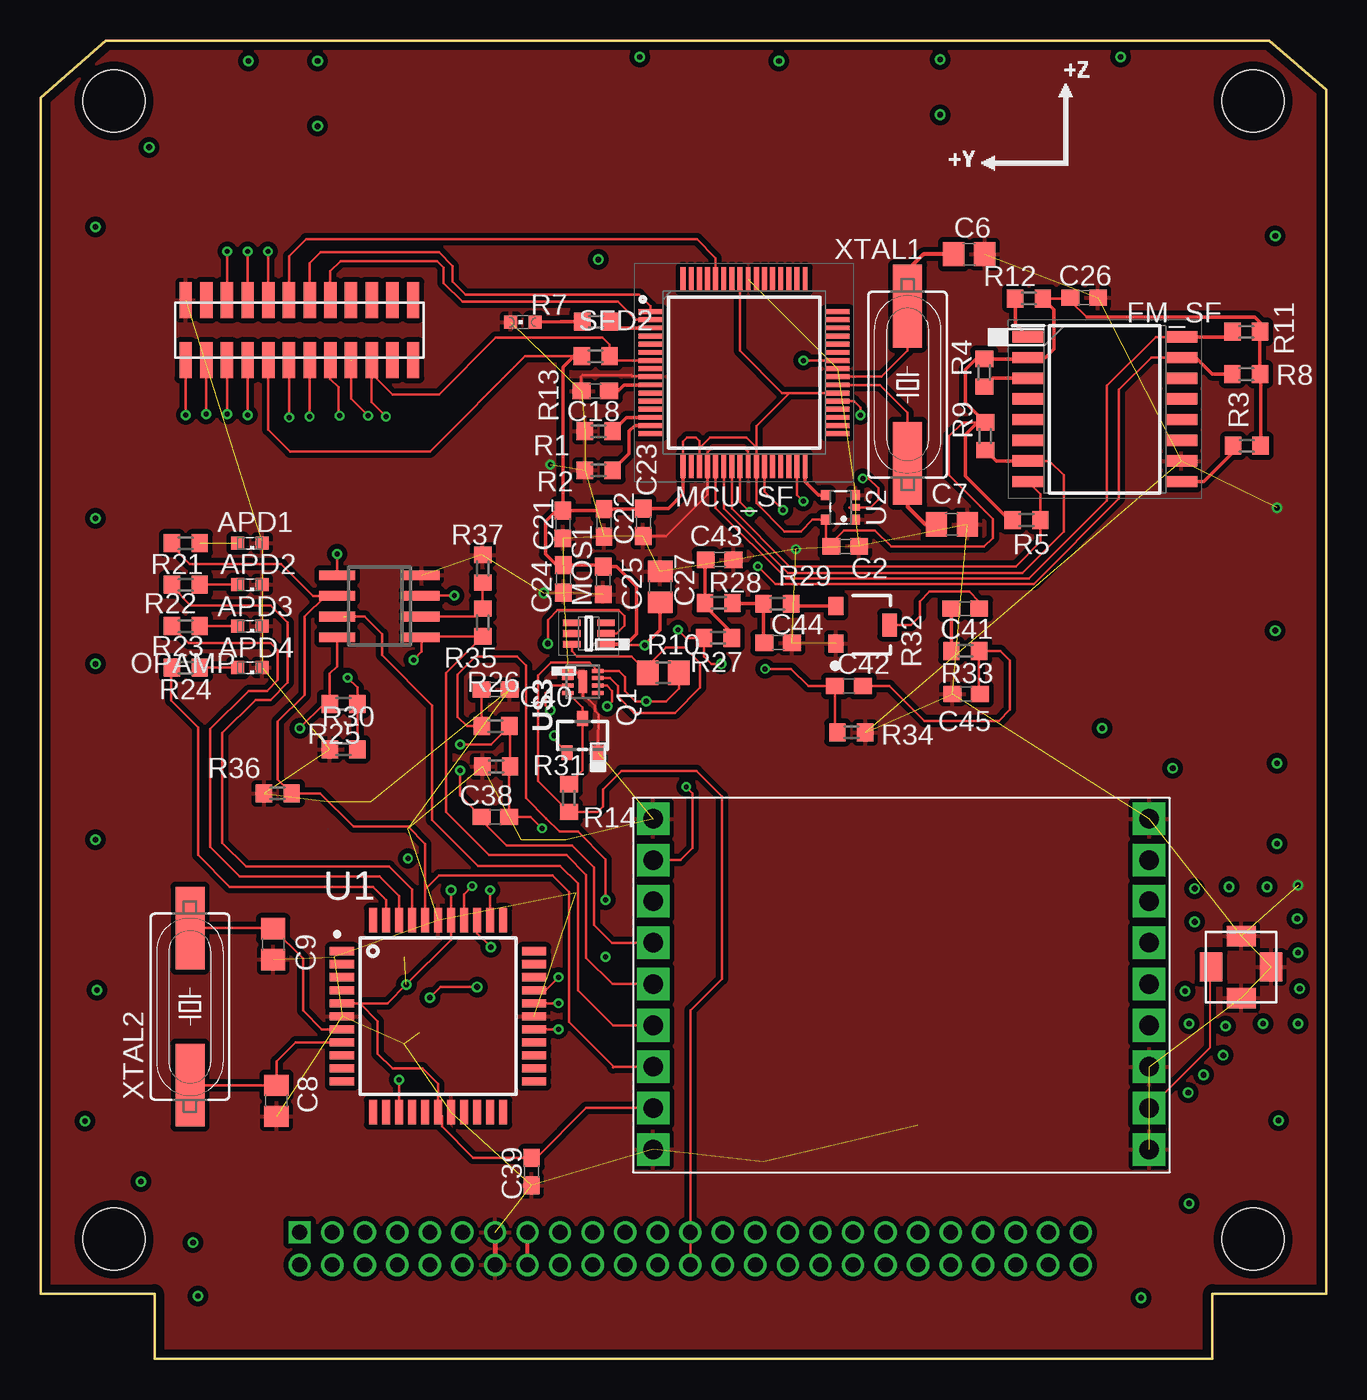
[diagram p4: board, top side]
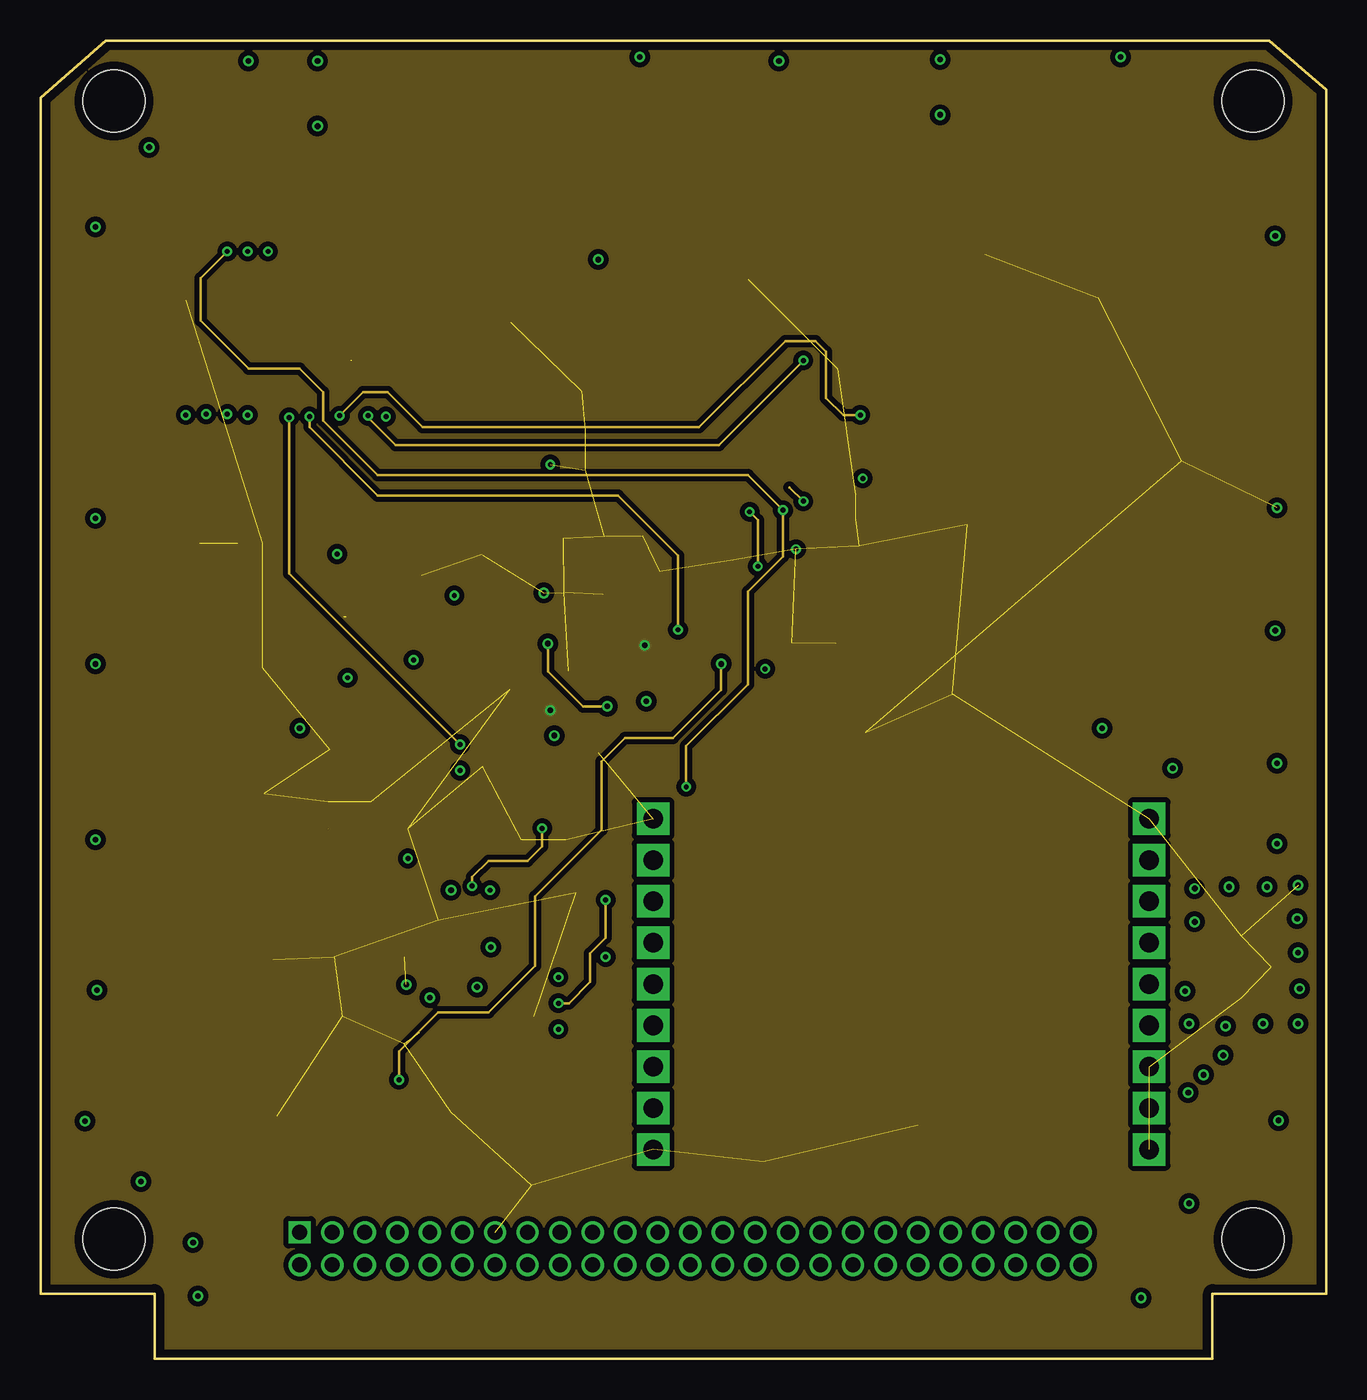
[diagram p5: board, inner layer Route2]
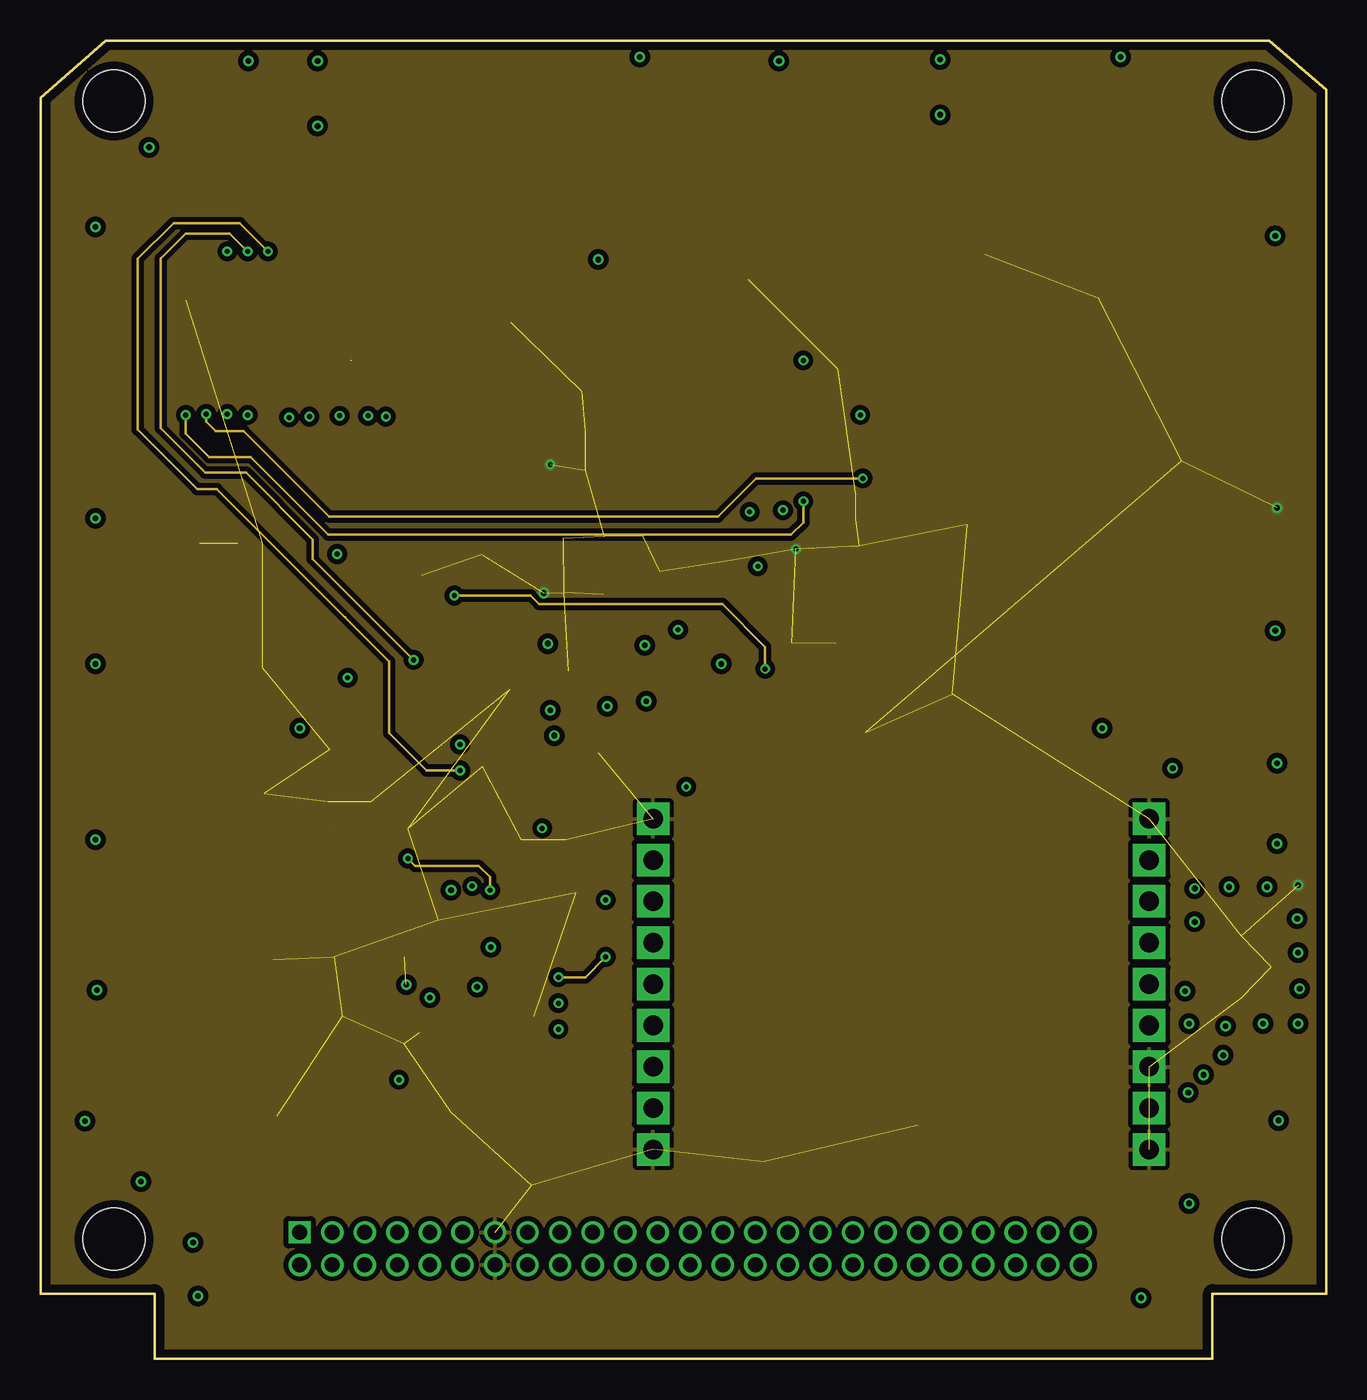
[diagram p6: board, inner layer Route15]
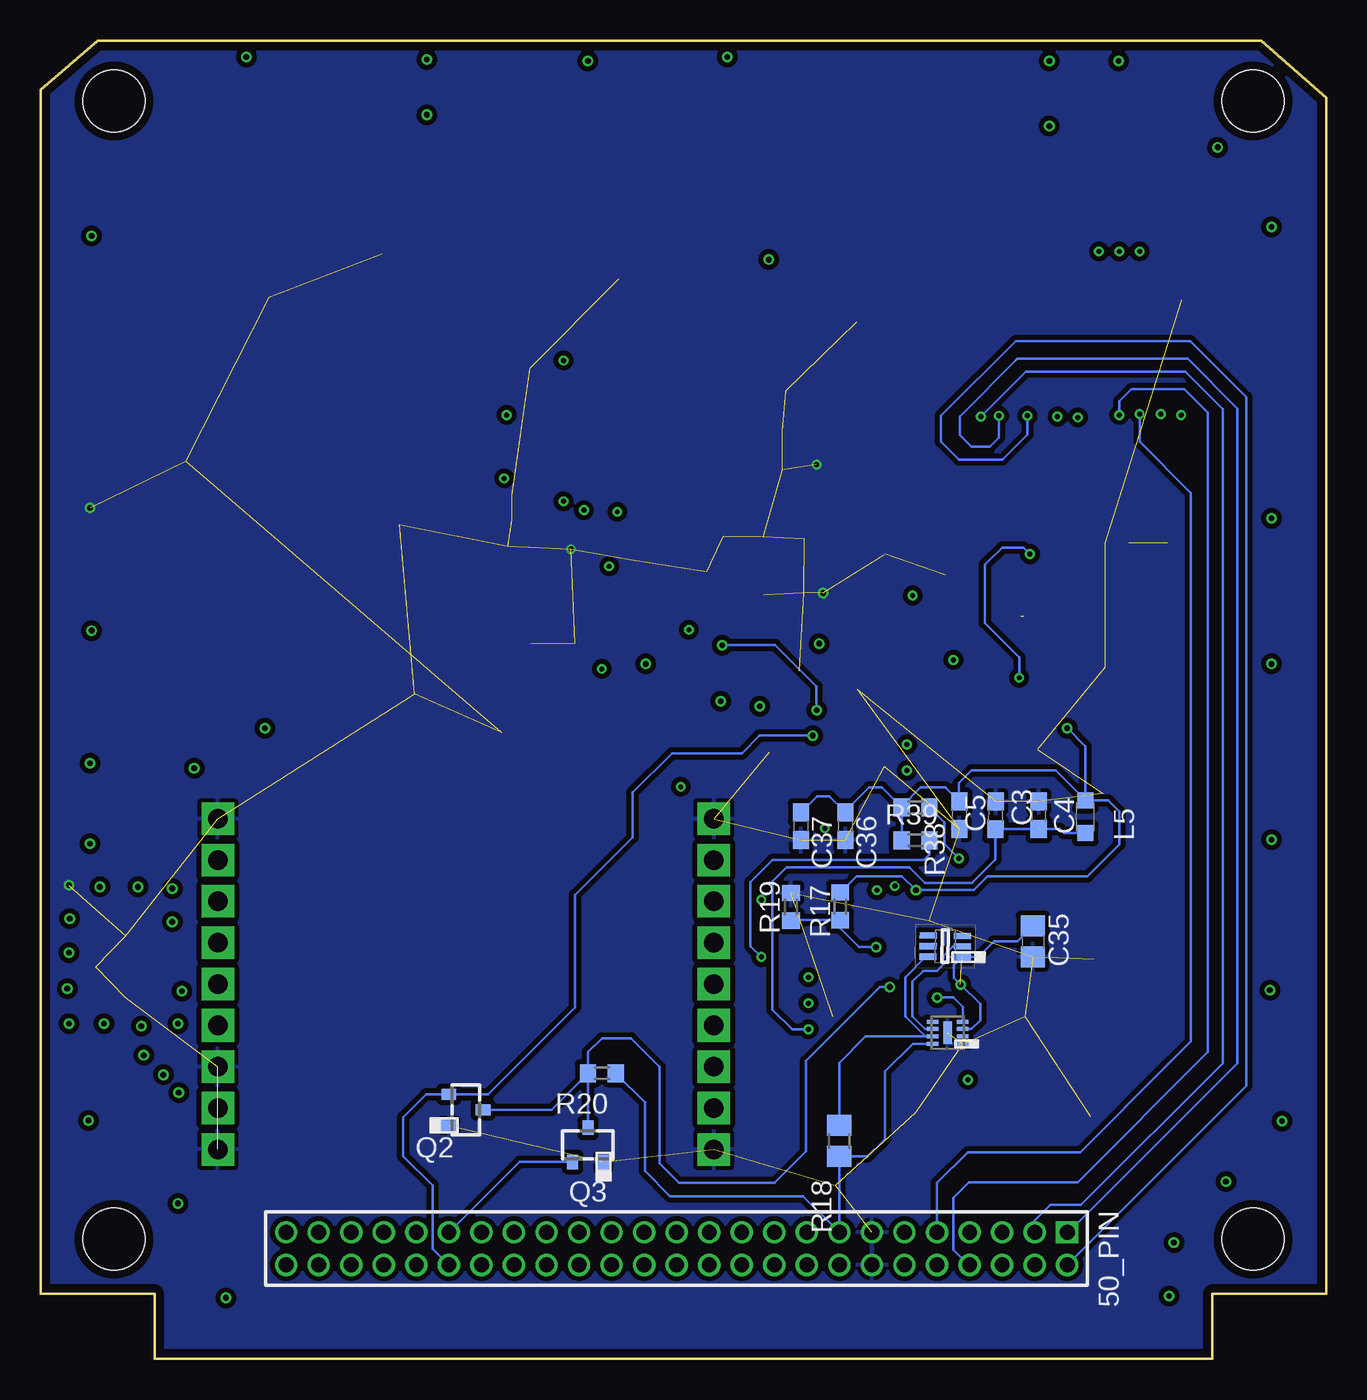
[diagram p7: board, bottom side, seen from below]

Size 79 x 81 mm. Coordinates in mm from the lower left corner, seen from the top.
Outline: 7,0 72,0 72,4 79,4 79,78 75.5,81 4,81 0,77.5 0,4 7,4 7,0
Copper layers (1+2*15+16): Top 0.018mm / dielectric 0.25mm / Route2 0.035mm / dielectric 1mm / Route15 0.035mm / dielectric 0.25mm / Bottom 0.018mm
Design rules "pban_5mil-l4 *": minimum track width 5mil, minimum drill 0.3mm, track to track 5mil, track to pad 0.229mm, pad to pad 5mil, via to via 5mil, smd to smd 5mil, copper to edge 0.5mm, drill to drill 0.5mm, minimum pad ring 0.15mm, minimum via ring 0.15mm, stop-mask expansion 0.05mm, vias tented up to drill 0.35mm, thermal gap 10mil
Holes 3.8 mm at 74.5,7.35 4.5,77.3 74.5,77.3 4.5,7.35

### Footprints (pad centres in the part's own frame; a part is rotated, then mirrored left to right if it is on the bottom)
2X25M = drill 0.914 square: 1 -24,-1 | drill 0.914: 2 -24,1; 3 -22,-1; 4 -22,1; 5 -20,-1; 6 -20,1; 7 -18,-1; 8 -18,1; 9 -16,-1; 10 -16,1; 11 -14,-1; 12 -14,1; 13 -12,-1; 14 -12,1; 15 -10,-1; 16 -10,1; 17 -8,-1; 18 -8,1; 19 -6,-1; 20 -6,1; 21 -4,-1; 22 -4,1; 23 -2,-1; 24 -2,1; 25 0,-1; 26 0,1; 27 2,-1; 28 2,1; 29 4,-1; 30 4,1; 31 6,-1; 32 6,1; 33 8,-1; 34 8,1; 35 10,-1; 36 10,1; 37 12,-1; 38 12,1; 39 14,-1; 40 14,1; 41 16,-1; 42 16,1; 43 18,-1; 44 18,1; 45 20,-1; 46 20,1; 47 22,-1; 48 22,1; 49 24,-1; 50 24,1
SML0603 = smd 0.8 x 0.8: A 0.75,0; C -0.75,0
C0603 = smd 1.1 x 1: 1 -0.85,0; 2 0.85,0
C0805 = smd 1.3 x 1.5: 1 -0.95,0; 2 0.95,0
SOIC127P1032X265-16N = smd 1.925 x 0.7: 1 -4.712,4.445; 2 -4.712,3.175; 3 -4.712,1.905; 4 -4.712,0.635; 5 -4.712,-0.635; 6 -4.712,-1.905; 7 -4.712,-3.175; 8 -4.712,-4.445; 9 4.712,-4.445; 10 4.712,-3.175; 11 4.712,-1.905; 12 4.712,-0.635; 13 4.712,0.635; 14 4.712,1.905; 15 4.712,3.175; 16 4.712,4.445
RAB_ACCESS = smd 2.2 x 0.76: P$1 -0.15,-0.635; P$2 3.55,-0.635; P$3 -0.15,-1.905; P$4 3.55,-1.905; P$5 -0.15,-3.175; P$6 3.55,-3.175; P$7 -0.15,-4.445; P$8 3.55,-4.445; P$9 -0.15,-5.715; P$10 3.55,-5.715; P$11 -0.15,-6.985; P$12 3.55,-6.985; P$13 -0.15,-8.255; P$14 3.55,-8.255; P$15 -0.15,-9.525; P$16 3.55,-9.525; P$17 -0.15,-10.795; P$18 3.55,-10.795; P$19 -0.15,-12.065; P$20 3.55,-12.065; P$21 -0.15,-13.335; P$22 3.55,-13.335; P$23 -0.15,-14.605; P$24 3.55,-14.605
L2012C = smd 1 x 1: 1 -1,0; 2 1,0
QFP50P1200X1200X120-64N = smd 1.475 x 0.3: 1 -5.738,3.75; 2 -5.738,3.25; 3 -5.738,2.75; 4 -5.738,2.25; 5 -5.738,1.75; 6 -5.738,1.25; 7 -5.738,0.75; 8 -5.738,0.25; 9 -5.738,-0.25; 10 -5.738,-0.75; 11 -5.738,-1.25; 12 -5.738,-1.75; 13 -5.738,-2.25; 14 -5.738,-2.75; 15 -5.738,-3.25; 16 -5.738,-3.75; 33 5.738,-3.75; 34 5.738,-3.25; 35 5.738,-2.75; 36 5.738,-2.25; 37 5.738,-1.75; 38 5.738,-1.25; 39 5.738,-0.75; 40 5.738,-0.25; 41 5.738,0.25; 42 5.738,0.75; 43 5.738,1.25; 44 5.738,1.75; 45 5.738,2.25; 46 5.738,2.75; 47 5.738,3.25; 48 5.738,3.75 | smd 0.3 x 1.475: 17 -3.75,-5.738; 18 -3.25,-5.738; 19 -2.75,-5.738; 20 -2.25,-5.738; 21 -1.75,-5.738; 22 -1.25,-5.738; 23 -0.75,-5.738; 24 -0.25,-5.738; 25 0.25,-5.738; 26 0.75,-5.738; 27 1.25,-5.738; 28 1.75,-5.738; 29 2.25,-5.738; 30 2.75,-5.738; 31 3.25,-5.738; 32 3.75,-5.738; 49 3.75,5.738; 50 3.25,5.738; 51 2.75,5.738; 52 2.25,5.738; 53 1.75,5.738; 54 1.25,5.738; 55 0.75,5.738; 56 0.25,5.738; 57 -0.25,5.738; 58 -0.75,5.738; 59 -1.25,5.738; 60 -1.75,5.738; 61 -2.25,5.738; 62 -2.75,5.738; 63 -3.25,5.738; 64 -3.75,5.738
MMCX_908_222101T = smd 1.778 x 1.397: P$1 0,-1.841; P$3 0,1.841 | smd 1.27 x 1.778: P$2 1.905,0; P$4 -1.905,0
SOT65P210X110-6N = smd 1.05 x 0.4: 1 -1.05,0.65; 2 -1.05,0; 3 -1.05,-0.65; 4 1.05,-0.65; 5 1.05,0; 6 1.05,0.65
SO08 = smd 0.6 x 2.2: 1 -1.905,-2.6; 2 -0.635,-2.6; 3 0.635,-2.6; 4 1.905,-2.6; 5 1.905,2.6; 6 0.635,2.6; 7 -0.635,2.6; 8 -1.905,2.6
SOT346-R = smd 0.7 x 0.9: 1 0.95,-1.05; 2 -0.95,-1.05; 3 0,1.05
R0603 = smd 1 x 1.1: 1 -0.85,0; 2 0.85,0
R0805 = smd 1.3 x 1.5: 1 -0.95,0; 2 0.95,0
TRIM_PVG3A200C01R00 = smd 1.1 x 0.9: 1 1.15,-1.65; 3 -1.15,-1.65 | smd 1.4 x 0.9: 2 0,1.65
CHIPLED_0603 = smd 0.8 x 0.8: A 0,-0.75; C 0,0.75
BIM1H = drill 1.2 pad 2 square: P$1 1.27,21.59; P$2 1.27,19.05; P$3 1.27,16.51; P$4 1.27,13.97; P$5 1.27,11.43; P$6 1.27,8.89; P$7 1.27,6.35; P$8 1.27,3.81; P$9 1.27,1.27; P$10 31.75,1.27; P$11 31.75,3.81; P$12 31.75,6.35; P$13 31.75,8.89; P$14 31.75,11.43; P$15 31.75,13.97; P$16 31.75,16.51; P$17 31.75,19.05; P$18 31.75,21.59
QFP80P1200X1200X120-44N = smd 1.5 x 0.5: 1 -5.9,4; 2 -5.9,3.2; 3 -5.9,2.4; 4 -5.9,1.6; 5 -5.9,0.8; 6 -5.9,0; 7 -5.9,-0.8; 8 -5.9,-1.6; 9 -5.9,-2.4; 10 -5.9,-3.2; 11 -5.9,-4; 23 5.9,-4; 24 5.9,-3.2; 25 5.9,-2.4; 26 5.9,-1.6; 27 5.9,-0.8; 28 5.9,0; 29 5.9,0.8; 30 5.9,1.6; 31 5.9,2.4; 32 5.9,3.2; 33 5.9,4 | smd 0.5 x 1.5: 12 -4,-5.9; 13 -3.2,-5.9; 14 -2.4,-5.9; 15 -1.6,-5.9; 16 -0.8,-5.9; 17 0,-5.9; 18 0.8,-5.9; 19 1.6,-5.9; 20 2.4,-5.9; 21 3.2,-5.9; 22 4,-5.9; 34 4,5.9; 35 3.2,5.9; 36 2.4,5.9; 37 1.6,5.9; 38 0.8,5.9; 39 0,5.9; 40 -0.8,5.9; 41 -1.6,5.9; 42 -2.4,5.9; 43 -3.2,5.9; 44 -4,5.9
SOT353-1 = smd 0.6 x 0.6: 1 -0.75,-0.9; 3 0.75,-0.9; 4 0.75,0.9; 5 -0.75,0.9 | smd 0.4 x 0.6: 2 0,-0.9
BIRDS5_LTC4361 = smd 0.25 x 0.7: 1 -0.675,-0.925; 2 -0.225,-0.925; 3 0.225,-0.925; 4 0.675,-0.925; 5 0.675,0.925; 6 0.225,0.925; 7 -0.225,0.925; 8 -0.675,0.925 | smd 1.37 x 0.54: 9 0,0
SM49 = smd 5.08 x 1.778: 1 -4.826,0; 2 4.826,0

### Placement (x,y rotation side)
50_PIN  39.92,6.77 180 bottom
APD1  12.87,50.12 180 top
APD2  12.87,47.57 180 top
APD3  12.87,45.02 180 top
APD4  12.87,42.47 180 top
C2  49.45,49.93 180 top
C3  20.32,33.4 89.6 bottom
C4  17.67,33.4 90 bottom
C5  22.55,33.4 90 bottom
C6  57.06,67.88 0 top
C7  55.99,51.27 0 top
C8  14.49,15.85 270 top
C9  14.29,25.48 270 top
C18  34.08,59.48 180 top
C21  32.09,51.27 270 top
C22  34.62,51.38 270 top
C23  37.03,51.41 270 top
C24  32.12,47.93 270 top
C25  34.57,47.83 270 top
C26  64.13,65.21 0 top
C27  38.07,47.44 90 top
C35  18.03,25.64 270 bottom
C36  29.55,32.73 270 bottom
C37  32.28,32.73 270 bottom
C38  27.94,33.3 180 top
C39  30.17,11.5 270 top
C40  27.95,41.13 0 top
C41  56.82,46.1 180 top
C42  49.67,41.35 180 top
C43  41.72,49.1 0 top
C44  45.32,44 0 top
C45  56.87,40.85 180 top
FM_SF  65.39,58.35 0 top
JP1  8.28,61.51 90 top
L5  14.81,33.31 270 bottom
MCU_SF  43.23,60.6 0 top
MMCX_908_222101T  73.77,24.07 270 top
MOS1  33.69,44.57 180 top
MOS2  23.42,25.35 179.3 bottom
OPAMP  20.82,46.25 90 top
Q1  33.3,38.3 0 top
Q2  52.87,15.3 270 bottom
Q3  45.37,13.15 0 bottom
R1  34.29,57 0 top
R2  34.29,54.6 0 top
R3  74.12,56.11 180 top
R4  57.99,60.59 270 top
R5  60.58,51.54 0 top
R7  34.13,63.73 0 top
R8  74.08,60.51 180 top
R9  58.05,56.69 270 top
R10  38.26,42.15 180 top
R11  74.09,63.11 180 top
R12  60.74,65.16 180 top
R13  34.11,61.61 0 top
R14  32.46,34.46 270 top
R17  29.87,27.81 270 bottom
R18  29.92,13.39 90 bottom
R19  32.9,27.78 90 bottom
R20  44.52,17.55 0 bottom
R21  8.92,50.12 0 top
R22  8.92,47.57 0 top
R23  8.92,45.02 0 top
R24  8.92,42.47 0 top
R25  18.62,40.25 0 top
R26  27.95,38.88 0 top
R27  41.62,44.3 0 top
R28  41.67,46.45 0 top
R29  45.27,46.4 0 top
R30  18.62,37.45 0 top
R31  28,36.4 180 top
R32  50.52,45.1 270 top
R33  56.82,43.5 0 top
R34  49.82,38.5 0 top
R35  27.17,45.25 90 top
R36  14.57,34.75 180 top
R37  27.17,48.55 90 top
R38  25.24,33.88 180 bottom
R39  25.24,31.86 180 bottom
SFD2  29.62,63.7 90 top
TRX1  69.39,34.46 180 top
U1  24.42,21.05 0 top
U2  49.16,52.32 90 top
U$1  23.27,20.04 90 bottom
U$3  33.32,41.6 270 top
XTAL1  53.27,59.86 270 top
XTAL2  9.18,21.64 90 top

### Tracks (layer width: path | path; a pad name or v marks a point on that pad's centre or on a via)
APRS_AFIN  (via drill 0.3)
  Top 0.152: 30.87,32.55 v30.82,32.6 30.12,33.3 C38.1 28.79,36.34 R31.1 28.85,38.84 R26.2 27.67,37.75 v25.77,37.75 25.72,37.75 | v26.52,29.05 26.02,28.55 U1.37 | v15.27,57.85 JP1.P$11
  Route2 0.152: v30.82,32.6 30.82,31.5 29.92,30.6 27.52,30.6 26.52,29.6 v26.52,29.05 | v25.77,37.75 15.27,48.25 v15.27,57.85
APRS_AFOUT  (via drill 0.3, 0.35)
  Top 0.152: 16.53,60.44 JP1.P$13 v16.52,57.9 | v41.82,42.7 41.22,42.7 40.77,43.15 R27.1 39.67,44.3 v39.17,44.8 | v22.02,17.15 U1.14
  Route2 0.152: v41.82,42.7 41.82,41.1 38.87,38.15 35.92,38.15 34.47,36.7 34.47,32.5 30.37,28.4 30.37,24.15 27.52,21.3 24.42,21.3 22.02,18.9 v22.02,17.15 22.02,17.1 | v39.17,44.8 39.17,49.35 35.47,53.05 20.72,53.05 16.52,57.25 v16.52,57.9
APRS_XTAL1
  Top 0.152: XTAL2.1 14.47,16.81 C8.1 14.49,18.27 15.67,19.45 U1.8
APRS_XTAL2
  Top 0.152: XTAL2.2 14.25,26.47 C9.1 16.12,24.6 16.12,21.4 17.27,20.25 U1.7
APRSDP_5V0  (via drill 0.35, 0.35 pad 0.6)  (1 unrouted)
  Top 0.152: TRX1.P$17 33.53,15.41 30.47,12.35 C39.1 26.59,12.35 24.66,14.27 24.66,14.91 U1.17 24.42,16.9 23.47,17.85 21.62,17.85 20.72,18.75 20.72,20.75 19.62,21.85 U1.5 21.32,21.85 v22.47,23 25.22,25.75 U1.38 v25.22,28.8 | v15.92,38.75 17.42,40.25 R25.1 17.77,42.1 18.22,42.55 OPAMP.8
  Bottom 0.152: 26.09,34.13 26.09,33.95 | C36.1 29.59,33.62 | 29.59,33.62 30.52,34.55 31.31,34.55 C37.1 | 29.83,28.87 R17.1 28.88,29.65 26.07,29.65 v25.22,28.8 21.67,28.8 20.82,29.65 14.67,29.65 12.72,31.6 12.72,33.65 13.38,34.31 L5.1 | C35.1 18.98,25.65 20.42,25.65 21.38,24.69 MOS2.1 22.87,24.2 22.87,23.4 v22.47,23 21.27,21.8 21.27,20.8 21.81,20.26 U$1.3 | L5.1 14.81,34.34 16.62,36.15 21.82,36.15 22.57,35.4 22.57,34.27 C5.2 23.4,35.1 24.94,35.1 26.09,33.95 | 26.09,33.9 R38.2 | 26.09,33.95 R38.2 | R38.2 R39.2 | R38.2 27.31,35.1 28.12,35.1 29.59,33.62 | L5.1 14.81,37.64 v15.92,38.75
APSF_MCU_RXB  (via drill 0.3)
  Top 0.152: 49.7,52.32 50.17,52.32 | U2.2 50.99,52.32 51.47,52.8 51.47,53.5 50.87,54.1 v50.52,54.1 50.47,54.1 | v10.17,58.05 JP1.P$3
  Top 0.2: 50.17,52.32 U2.2
  Route15 0.152: v50.52,54.1 43.97,54.1 41.62,51.75 17.72,51.75 12.47,57 10.77,57 10.17,57.6 v10.17,58.05
APSF_MCU_RXB-2
  Top 0.2: MCU_SF.32 46.98,53.9 47.81,53.07 U2.4
APSF_MCU_TXB  (via drill 0.3)
  Top 0.152: MCU_SF.31 46.48,53.09 v46.87,52.7 46.92,52.65 | v8.92,58 v8.91,58.01 JP1.P$1
  Route2 0.152: v46.87,52.7 46.02,53.55
  Route15 0.152: v46.87,52.7 46.87,51.4 46.12,50.65 17.67,50.65 12.92,55.4 10.37,55.4 8.92,56.85 v8.92,58
AREF  (via drill 0.3)
  Top 0.152: C40.1 R26.1 26.19,38.88 25.62,39.45 25.62,42.05 26.72,43.15 29.27,43.15 29.82,42.6 29.82,34.45 31.06,33.2 31.07,33.2 31.87,32.4 33.02,32.4 34.72,30.7 v34.72,28.2 34.72,28.1 | v31.82,21.85 U1.29
  Route2 0.152: v34.72,28.2 34.72,25.85 33.77,24.9 33.77,23.15 32.47,21.85 v31.82,21.85 31.77,21.85
AVCC  (via drill 0.3)  (1 unrouted)
  Top 0.152: v31.82,20.25 U1.27
  Bottom 0.152: 14.66,32.46 L5.2 16.12,32.3 16.37,32.55 C4.1 | C4.1 C3.1 20.32,30.7 21.77,29.25 24.67,29.25 25.62,30.2 33.17,30.2 34.02,29.35 34.02,21.45 32.82,20.25 v31.82,20.25 | C4.1
DEBUG
  Top 0.152: JP1.P$12 15.26,67.74 16.32,68.8 40.32,68.8 41.48,67.64 MCU_SF.60
FM_RESET
  Top 0.2: FM_SF.3 58.5,60.25 R4.2
FM_W#
  Top 0.2: FM_SF.9 71.47,53.91 73.27,55.7 R3.2
GATE3  (via drill 0.35)
  Top 0.152: MOS1.2 35.39,44.57 35.87,45.05 35.87,45.65 35.52,46 31.77,46 31.17,45.4 v31.17,43.95 | v34.82,40.1 35.12,40.4 35.12,41.05 34.79,41.38 U$3.6
  Route2 0.152: v34.82,40.1 33.32,40.1 31.17,42.25 v31.17,43.95
GATE4
  Bottom 0.152: U$1.6 24.21,20.28 24.67,20.28 25.42,21.03 25.42,23.2 24.77,23.85 23.92,23.85 23.52,24.25 23.52,24.75 22.93,25.34 MOS2.2
GND  (via drill 0.3, 0.35)  (67 unrouted)
  Top 0.127: 43.5,66.38 MCU_SF.56 | 50_PIN.13 27.92,7.7 27.92,7.67 | 40.98,54.95 40.97,54.95 MCU_SF.20 | 27.92,5.92 50_PIN.14
  Top 0.152: MCU_SF.20 | MCU_SF.20 40.98,54.95 40.98,55.68 41.2,55.91 41.22,55.91 41.27,55.95 43.27,55.95 43.48,55.74 MCU_SF.25 | U$3.1 32.85,42.27 33.05,42.08 33.05,41.87 U$3.9 33.32,40.74 33.44,40.62 33.58,40.62 34.08,40.12 34.08,39.8 34.28,39.6 34.28,38.66 34.25,38.63 Q1.1 | MCU_SF.56 | C18.2 33.22,60.36 33.3,60.44 36.3,60.44 36.35,60.39 37.44,60.39 MCU_SF.9 | MCU_SF.20 40.98,53.1 38.44,50.56 C23.2 | R37.2 27.12,49.45
  Top 0.305: 50_PIN.13 50_PIN.14
  other vias: 46.42,49.75 31.32,54.95 30.92,47.06 75.97,52.3 77.27,29.1
  pour Top (isolate 0.305): -9.09,81.6 86.17,81.6 86.17,-0.9 -9.09,-0.9
  pour Bottom (isolate 0.305): -9.43,81.85 86.62,81.85 86.67,81.9 86.67,-1.2 -9.43,-1.2 -9.48,-1.25 -9.48,81.8
  pour Route15 (isolate 0.305): -9.73,82.8 87.32,82.8 87.32,-1.45 -9.68,-1.45 -9.68,82.75
HOLD
  Top 0.2: R12.2 59.89,63.58 FM_SF.1
LED
  Top 0.2: MCU_SF.3 35.36,63.35 R7.2
LED2_GRN
  Top 0.152: U1.41 22.82,28.85 21.42,30.25 12.62,30.25 11.17,31.7 11.17,38.45 13.22,40.5 14.12,40.5 15.17,41.55 15.17,45.25 14.12,46.3 9.22,46.3 8.07,47.45 R22.1
LED3_YLW
  Top 0.152: U1.42 22.02,28.45 20.82,29.65 12.22,29.65 10.42,31.45 10.42,38.7 12.77,41.05 13.92,41.05 14.57,41.7 14.57,43.55 14.12,44 9.09,44 R23.1
LED4_BLU
  Top 0.152: U1.43 21.22,28.2 20.42,29 11.62,29 9.67,30.95 9.67,38.8 8.02,40.45 8.02,42.42 R24.1
MB_DIO_APRSDP_5V0
  Bottom 0.152: 53.87,7.82 50_PIN.39 49.59,12.1 Q3.2
MB_DIO_SFWARD_3V3  (via drill 0.35 pad 0.6)
  Top 0.152: 32.32,37.23 Q1.2 31.57,38.03 v31.57,38.3
  Top 0.2: Q1.2 32.15,37.05
  Bottom 0.152: 50_PIN.40 54.92,6.77 54.92,10.65 56.72,12.45 56.72,14.85 55.32,16.25 Q2.2 51.52,16.25 46.17,21.6 46.17,28.5 42.62,32.05 42.62,34.8 40.22,37.2 35.92,37.2 34.82,38.3 v31.57,38.3
MB_SF_RX
  Top 0.152: JP1.P$14 16.53,67.31 17.22,68 24.47,68 25.32,67.15 25.32,66.2 26.12,65.4 36.77,65.4 37.47,64.7 37.47,64.37
  Top 0.2: MCU_SF.1 37.47,64.37 38.05,64.37
MB_SF_TX
  Top 0.152: MCU_SF.2 36.57,63.85 35.47,64.95 25.92,64.95 24.77,66.1 24.77,67.05 24.37,67.45 18.42,67.45 17.8,66.83 JP1.P$16
MCLR  (via drill 0.3)
  Top 0.152: MCU_SF.7 35.22,61.35 R13.2 34.96,62.31 34.52,62.75 27.97,62.75 24.47,59.25 21.62,59.25 20.34,60.53 JP1.P$19 20.34,58.78 v21.22,57.9
  Bottom 0.152: v21.22,57.9 18.47,60.65 8.67,60.65 6.37,58.35 6.37,18.15 15.07,9.45 16.97,9.45 17.92,8.5 50_PIN.3
N$1  (via drill 0.3)
  Top 0.152: v27.62,28.8 U1.35
  Route15 0.152: v22.57,30.75 23.02,30.3 26.92,30.3 27.62,29.6 v27.62,28.8
  Bottom 0.152: v22.57,30.75 23.47,31.65 23.47,32.96 R38.1
N$2
  Top 0.2: C18.1 35.49,59.48 35.86,59.85 MCU_SF.10
N$3  (via drill 0.3)
  Top 0.152: v31.82,23.45 31.02,22.65 U1.30
  Route15 0.152: v34.72,24.7 33.47,23.45 v31.82,23.45
  Bottom 0.152: R39.1 24.39,31.68 | 24.23,31.86 R39.1 | R39.1 24.39,30.98 24.72,30.65 34.02,30.65 35.37,29.3 35.37,25.35 v34.72,24.7
N$4  (via drill 0.35)
  other vias: 70.52,16.35
N$5  (via drill 0.35)
  other vias: 71.47,17.45
N$6  (via drill 0.35)
  other vias: 72.67,18.65
N$7
  Top 0.2: MCU_SF.14 35.99,57.85 R1.2
N$8
  Top 0.2: MCU_SF.15 36.52,57.35 36.17,57 36.17,55.63 R2.2
N$9  (via drill 0.35)
  other vias: 72.82,20.45
N$10
  Top 0.2: R32.3 46.27,46.25 R29.2
N$11
  Top 0.2: R7.1 31.95,63.73 SFD2.A
N$12  (1 unrouted)
N$13
  Top 0.152: R22.2 APD2.A
N$14
  Top 0.152: R23.2 APD3.A
N$15
  Top 0.152: R24.2 APD4.A
N$16
  Top 0.2: R27.2 42.47,44.6 40.82,46.25 R28.1 40.82,49.05 C43.1
N$17
  Top 0.2: C44.1 44.42,44.05 R29.1 42.57,46.4 R28.2
N$18
  Top 0.152: C45.1 57.67,40.9 R33.2 58.97,43.5 59.57,42.9 59.57,39.9 58.87,39.2 54.32,39.2 52.17,41.35 C42.1
N$19
  Top 0.2: R33.1 C41.2
N$20
  Top 0.152: R37.1 R35.2 26.68,45.62 OPAMP.2
N$21  (via drill 0.3)
  Top 0.152: v18.87,41.85 19.47,41.25 R25.2 R30.2 | v18.22,49.45 OPAMP.5
  Bottom 0.152: v18.87,41.85 18.87,43.1 20.97,45.2 20.97,48.8 19.92,49.85 18.62,49.85 v18.22,49.45
N$22
  Top 0.152: R32.2 53.47,45.1 54.02,45.65 54.02,46.55 54.62,47.15 57.07,47.15 57.67,46.55 C41.1
  Top 0.2: 52.52,45.1 R32.2
N$23  (via drill 0.35)
  other vias: 75.12,20.6
N$24  (via drill 0.35)
  other vias: 77.27,20.6
N$25  (via drill 0.35)
  other vias: 77.37,22.75
N$26  (via drill 0.35)
  other vias: 77.27,24.95
N$27  (via drill 0.35)
  other vias: 77.22,27.05
N$29  (via drill 0.35)
  other vias: 75.37,29
N$30  (via drill 0.35)
  other vias: 73.02,29
N$31  (via drill 0.35)
  other vias: 70.92,28.9
N$32  (via drill 0.35)
  other vias: 70.92,26.85
N$33  (via drill 0.35)
  other vias: 70.57,20.6
N$34  (via drill 0.35)
  other vias: 70.32,22.6
N$35  (via drill 0.35)
  other vias: 3.37,69.55
N$37  (via drill 0.35)
  other vias: 45.37,79.75
N$38  (via drill 0.35)
  other vias: 3.37,51.65
N$39  (via drill 0.35)
  other vias: 3.37,42.7
N$40  (via drill 0.35)
  other vias: 3.37,31.9
N$41  (via drill 0.35)
  other vias: 3.47,22.65
N$42  (via drill 0.35)
  other vias: 70.57,9.55
N$43  (via drill 0.35)
  other vias: 67.62,3.75
N$44  (via drill 0.35)
  other vias: 2.72,14.6
N$45  (via drill 0.35)
  other vias: 6.17,10.9
N$46  (via drill 0.35)
  other vias: 9.37,7.15
N$47  (via drill 0.35)
  other vias: 9.67,3.85
N$48  (via drill 0.35)
  other vias: 55.27,79.85
N$49  (via drill 0.35)
  other vias: 66.37,80
N$50  (via drill 0.35)
  other vias: 75.87,69
N$53  (via drill 0.35)
  other vias: 75.87,44.75
N$54  (via drill 0.35)
  other vias: 75.97,36.6
N$55  (via drill 0.35)
  other vias: 75.97,31.65
N$56  (via drill 0.35)
  other vias: 76.07,14.65
N$57  (via drill 0.35)
  other vias: 65.22,38.75
N$58  (via drill 0.35)
  other vias: 69.57,36.3
N$78  (via drill 0.35)
  other vias: 6.67,74.45
N$80  (via drill 0.35)
  other vias: 12.77,79.75
N$81  (via drill 0.35)
  other vias: 17.02,79.75
N$82  (via drill 0.35)
  other vias: 17.02,75.75
N$84  (via drill 0.35)
  other vias: 34.27,67.55
N$88  (via drill 0.35)
  other vias: 36.82,80
N$100  (via drill 0.35)
  other vias: 55.27,76.45
ON3
  Top 0.152: U$3.4 33.3,40.02 Q1.3 33.3,36.15 R14.1
  Top 0.2: Q1.3 33.3,39.25
ON4  (via drill 0.35 pad 0.6)
  Top 0.152: v26.82,22.85 24.57,22.85 v23.92,22.2 23.87,22.15
  Bottom 0.152: Q2.3 47.62,15.3 R20.1 | Q3.3 R20.1 | R20.1 45.37,18.85 44.52,19.7 42.72,19.7 40.97,17.95 40.97,12 39.77,10.8 33.92,10.8 31.97,12.75 31.97,18.3 27.42,22.85 v26.82,22.85 26.77,22.85 | U$1.4 22.34,21.62 22.92,22.2 v23.92,22.2
OPAMP_A+  (via drill 0.3)
  Top 0.152: C42.2 48.82,38.65 R34.1 | C42.2 48.77,41.3 | C42.2 47.17,41.35 46.12,42.4 v44.52,42.4 44.47,42.4 | v25.42,46.9 23.43,46.9 OPAMP.3
  Route15 0.152: v44.52,42.4 44.52,43.75 41.89,46.38 30.64,46.38 30.12,46.9 v25.42,46.9
OSC1
  Top 0.152: XTAL1.1 53.27,61.95 51.67,60.35 MCU_SF.40
  Top 0.254: C6.1 54.26,67.88 53.27,66.89 XTAL1.1
OSC2
  Top 0.152: MCU_SF.39 51.57,59.85 53.27,58.15 53.27,54.9
  Top 0.254: XTAL1.2 53.27,54.9 53.27,52.38 54.38,51.27 C7.1
PA1  (via drill 0.35)
  Top 0.152: v27.67,25.3 26.82,26.15 U1.36
  Bottom 0.152: R17.2 32.87,26.96 R19.1 | R17.2 29.87,26.6 | R17.2 29.87,26.45 28.72,25.3 v27.67,25.3
PD0_RXA  (via drill 0.3)
  Top 0.152: JP1.P$7 v12.72,58
  Bottom 0.152: v12.72,58 12.72,58.85 11.97,59.6 8.72,59.6 7.27,58.15 7.27,18.85 15.27,10.85 21.97,10.85 22.92,9.9 22.92,6.7 21.99,5.77 50_PIN.8
PD1_TXA  (via drill 0.3)
  Top 0.152: JP1.P$5 11.45,58.07 v11.47,58.05
  Bottom 0.152: 50_PIN.9 23.92,10.8 22.02,12.7 15.12,12.7 9.69,18.12 9.52,18.3 8.32,19.5 8.32,53.2 11.47,56.35 v11.47,58.05
PGC  (via drill 0.3)  (2 unrouted)
  Top 0.127: 19.1,61.73 19.1,61.36 | 19.06,61.73 19.04,61.73
  Top 0.152: MCU_SF.42 v46.87,61.35 | JP1.P$17 19.07,59 v20.12,57.95
  Top 0.2: JP1.P$17 19.06,61.73
  Route2 0.152: 20.07,57.9 v20.12,57.95 20.12,57.85 21.82,56.15 41.67,56.15 v46.87,61.35
  Bottom 0.152: v20.12,57.95 20.12,56.6 20.67,56.05 21.82,56.05 22.52,56.75 22.52,57.9 18.97,61.45 8.52,61.45 5.47,58.4 5.47,18.15 15.85,7.77 50_PIN.1
PGD  (via drill 0.3)
  Top 0.152: JP1.P$15 17.8,60.22 18.32,59.7 18.32,58 v18.37,57.95 | MCU_SF.37 49.97,58.85 50.37,58.45 v50.37,58 50.37,57.95
  Route2 0.152: v50.37,58 49.32,58 48.27,59.05 48.27,61.9 47.62,62.55 45.77,62.55 40.47,57.25 23.47,57.25 21.32,59.4 19.82,59.4 v18.37,57.95
  Bottom 0.152: v18.37,57.95 18.37,56.8 19.92,55.25 22.57,55.25 23.67,56.35 23.67,57.95 19.07,62.55 8.37,62.55 4.92,59.1 4.92,16.77 50_PIN.2
RSSI  (via drill 0.3)
  Top 0.152: 11.45,64.01 JP1.P$6 11.47,65.08 v11.47,68.05 | 44.47,54.87 MCU_SF.27 44.48,53.29 v45.62,52.15 | TRX1.P$11 39.32,30.65 40.07,31.4 40.07,34.75 v39.67,35.15 39.62,35.2
  Route2 0.152: v39.67,35.15 39.67,37.65 43.47,41.45 43.47,47.15 45.62,49.3 v45.62,52.15 | v45.62,52.15 45.62,52.2 | v45.62,52.15 43.47,54.3 31.05,54.3 31.04,54.3 20.72,54.3 17.37,57.65 17.37,59.4 15.92,60.85 15.67,60.85 15.52,60.85 12.77,60.85 9.82,63.8 9.82,66.4 v11.47,68.05
SENSE3
  Top 0.152: MOS1.6 32.64,43.48 32.97,43.15 36.31,43.15 R10.2 | 37.08,41.92 R10.2 | R10.2 37.31,42.59 38.42,43.7 39.57,43.7 40.52,42.75 40.52,41.25 38.97,39.7 36.47,39.7 35.47,40.7 35.47,41.35 34.99,41.83 U$3.7
SENSE4
  Bottom 0.152: R18.2 29.92,18.2 28.31,19.81 U$1.7 24.21,19.83 24.67,19.83 25.87,21.03 25.87,23.45 24.6,24.71 MOS2.6
SFWARD_3V3_2  (via drill 0.35)
  Top 0.127: 43.99,54.95 43.99,54.86 | 44.01,54.95 43.99,54.95 | 43.99,54.95 43.98,54.95
  Top 0.152: 39.52,54.91 MCU_SF.17 39.48,56.36 39.72,56.6 40.27,56.6 40.48,56.39 MCU_SF.19 | 40.43,54.91 MCU_SF.19 | 43.98,54.95 MCU_SF.26 | MCU_SF.26 | MCU_SF.26 43.98,52.59 45.72,50.85 46.72,50.85 47.44,51.57 U2.5 48.26,50.27 C2.2 48.6,50.13 49.37,50.9 51.27,50.9 52.27,49.9 57.97,49.9 58.52,50.45 58.52,51.6 55.82,54.3 55.82,56.7 56.66,57.54 R9.1 | v31.32,39.85 31.02,40.15 31.02,40.9 31.49,41.38 U$3.3 | v37.12,43.85 34.81,43.85 MOS1.1 | R12.1 63.23,65.16 C26.1 63.28,65 64.28,64 | MCU_SF.26 43.98,55.99 43.37,56.6 41.12,56.6 40.48,55.96 MCU_SF.19 | MCU_SF.26 43.98,57.31 46.02,59.35 MCU_SF.38 45.57,59.35 42.97,61.95 42.97,66.33 MCU_SF.57 | R13.1 29.78,61.61 23.92,55.75 15.32,55.75 13.97,57.1 13.97,61.34 JP1.P$9
  Top 0.2: R3.1 74.97,60.47 R8.1 R11.1 74.94,63.68 74.62,64 64.28,64 | R12.1 62.27,64.48 62.27,62.05 61.74,61.52 FM_SF.2 60.59,61.44 R4.1 57.46,61.44 56.82,60.8 56.82,58.77 R9.1 57.56,57.54 56.82,56.8 56.82,54.25 59.53,51.54 R5.1 | MCU_SF.17 39.48,53.16 38.58,52.26 C23.1 37,52.23 C22.1 34.51,52.12 C21.1 | C21.1 31.69,52.12 31.02,51.45 31.02,49.45 31.69,48.78 C24.1 34.47,48.78 C25.1 35.39,48.68 36.62,47.45 36.62,44.55 35.99,43.92 MOS1.1 | R13.1 32.77,61.61 32.09,60.93 C21.1 | C27.1 38.07,44.8 v37.12,43.85
  Bottom 0.152: v31.32,39.85 31.32,41.3 33.87,43.85 v37.12,43.85
  pour Route2 (isolate 0.305): -9.03,-0.7 86.97,-0.7 86.97,82.3 -9.03,82.3
SPI_FM_CS
  Top 0.152: FM_SF.7 61.99,55.17 62.87,54.3 62.87,50.85 60.32,48.3 45.92,48.3 41.98,52.24 MCU_SF.22
  Top 0.2: FM_SF.7 58.74,55.17 58.08,55.84 R9.2
SPI_MISO
  Top 0.152: FM_SF.8 61.43,53.15 R5.2 61.43,50.21 59.92,48.7 46.02,48.7 42.48,52.24 MCU_SF.23
SPI_MOSI  (via drill 0.3)
  Top 0.152: FM_SF.15 68.24,61.52 66.27,59.55 66.27,52.85 61.02,47.6 45.17,47.6 v44.07,48.7 44.07,48.75 | MCU_SF.24 42.98,52.64 v43.57,52.05
  Top 0.2: FM_SF.15 70.99,61.52 72.01,60.51 R8.2
  Route2 0.152: v44.07,48.7 44.07,51.55 v43.57,52.05 43.52,52.1
SPI_SCK
  Top 0.152: FM_SF.16 68.51,62.8 65.52,59.8 65.52,52.75 60.72,47.95 45.82,47.95 41.48,52.29 MCU_SF.21
  Top 0.2: FM_SF.16 72.92,62.8 R11.2
SUP_3V3_2  (via drill 0.35)
  Top 0.152: 50_PIN.26 50_PIN.25 39.92,21.4 41.87,23.35 41.87,34.55 40.29,36.12 35.69,36.12 34.57,35 34.57,33.95 34.23,33.61 R14.2 30.57,35.5 30.57,42 31.37,42.8 33.72,42.8 U$3.8 35.54,42.27 35.92,41.9 35.92,41.05 36.57,40.4 v37.22,40.4 38.42,40.4 39.22,41.2 R10.1
  Top 0.2: R10.1 38.97,42.15
SUP_5V0
  Top 0.254: 50_PIN.16 50_PIN.15
  Bottom 0.152: 29.96,12.4 R18.1 | R20.2 41.87,15.75 41.87,11.55 40.32,10 32.15,10 50_PIN.15 R18.1 | R18.1 28.18,12.44 27.12,13.5 27.12,17.65 25.41,19.36 U$1.8
TRX1
  Top 0.127: 71.94,24.06 71.86,23.98 71.86,19.13 68.18,15.45 TRX1.P$2
TRX1_AFOUT  (via drill 0.3)
  Top 0.152: 27.09,32.93 C38.2 | C38.2 27.09,33.08 28.62,31.55 32.67,31.55 34.02,30.2 34.02,26.65 35.1,25.57 TRX1.P$13 | C38.2 25.77,34.62 v25.77,36.15 | v13.97,68.05 13.99,68.03 JP1.P$10
  Route15 0.152: v25.77,36.15 23.72,36.15 21.42,38.45 21.42,42.85 10.82,53.45 9.62,53.45 5.97,57.1 5.97,67.6 8.17,69.8 12.22,69.8 v13.97,68.05
TRX1_RXSELECT
  Top 0.152: TRX1.P$16 35.22,17.95 | 35.22,17.95 35.17,17.9 | 35.22,17.95 32.47,20.7 32.47,28.7 31.47,29.7 24.47,29.7 23.62,28.85 | 23.62,28.85 23.62,28.75 U1.40 | R21.1 8.07,49.95 9.17,48.85 14.77,48.85 16.73,46.88 OPAMP.6 17.5,46.88 16.22,45.6 16.22,40.8 14.57,39.15 14.57,35.6 R36.1 17.17,34.75 19.22,32.7 22.57,32.7 23.62,31.65 23.62,28.85
TRX1_TXD  (via drill 0.3)
  Top 0.152: TRX1.P$14 35.14,23.03 33.52,24.65 33.52,29.75 32.32,30.95 27.57,30.95 24.92,33.6 24.92,42.15 R35.1 23.47,44.4 OPAMP.1 23.42,43.45 v22.92,42.95 | v12.72,68.05 JP1.P$8
  Route15 0.152: v22.92,42.95 16.72,49.15 16.72,50.35 12.62,54.45 10.12,54.45 7.37,57.2 7.37,67.6 8.92,69.15 11.62,69.15 v12.72,68.05
TRX1_TXSELECT  (1 unrouted)
  Top 0.152: 18.78,45.62 OPAMP.7 | TRX1.P$15 35.18,20.49 33.02,22.65 33.02,29.2 31.92,30.3 26.87,30.3 24.07,33.1 24.07,40.15 20.97,43.25 20.97,44.55 19.9,45.62 18.62,45.62